# EasyEDA Pro project ProProject_AT_START_F426 V1.0.epro, board AT-START-F426-V1.0
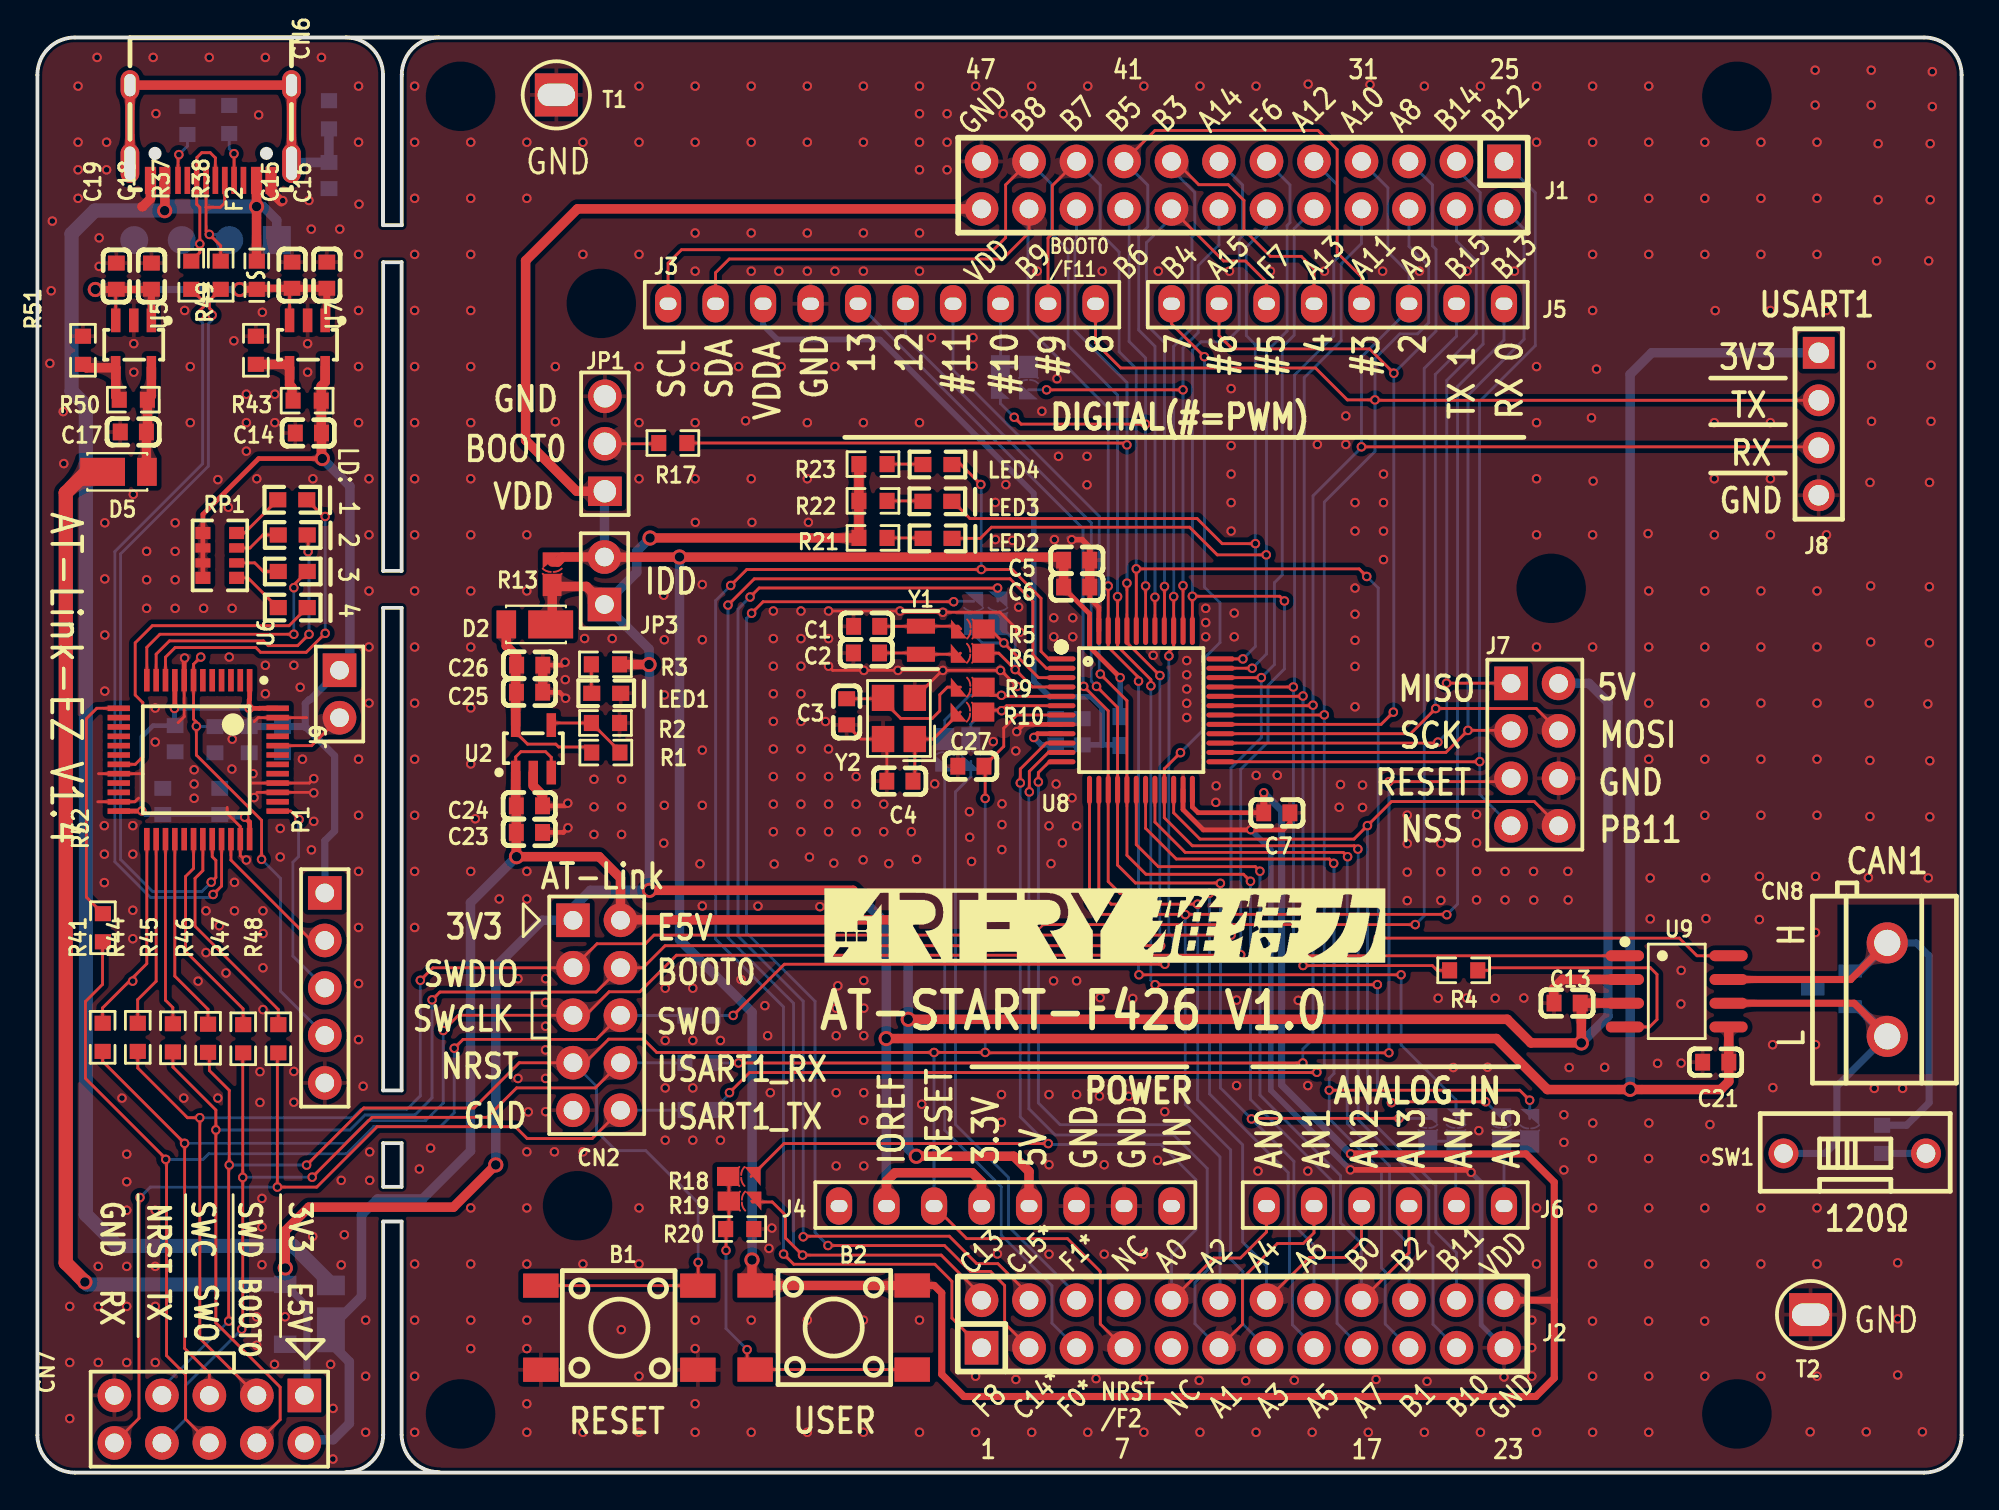
[diagram p4: board, top side]
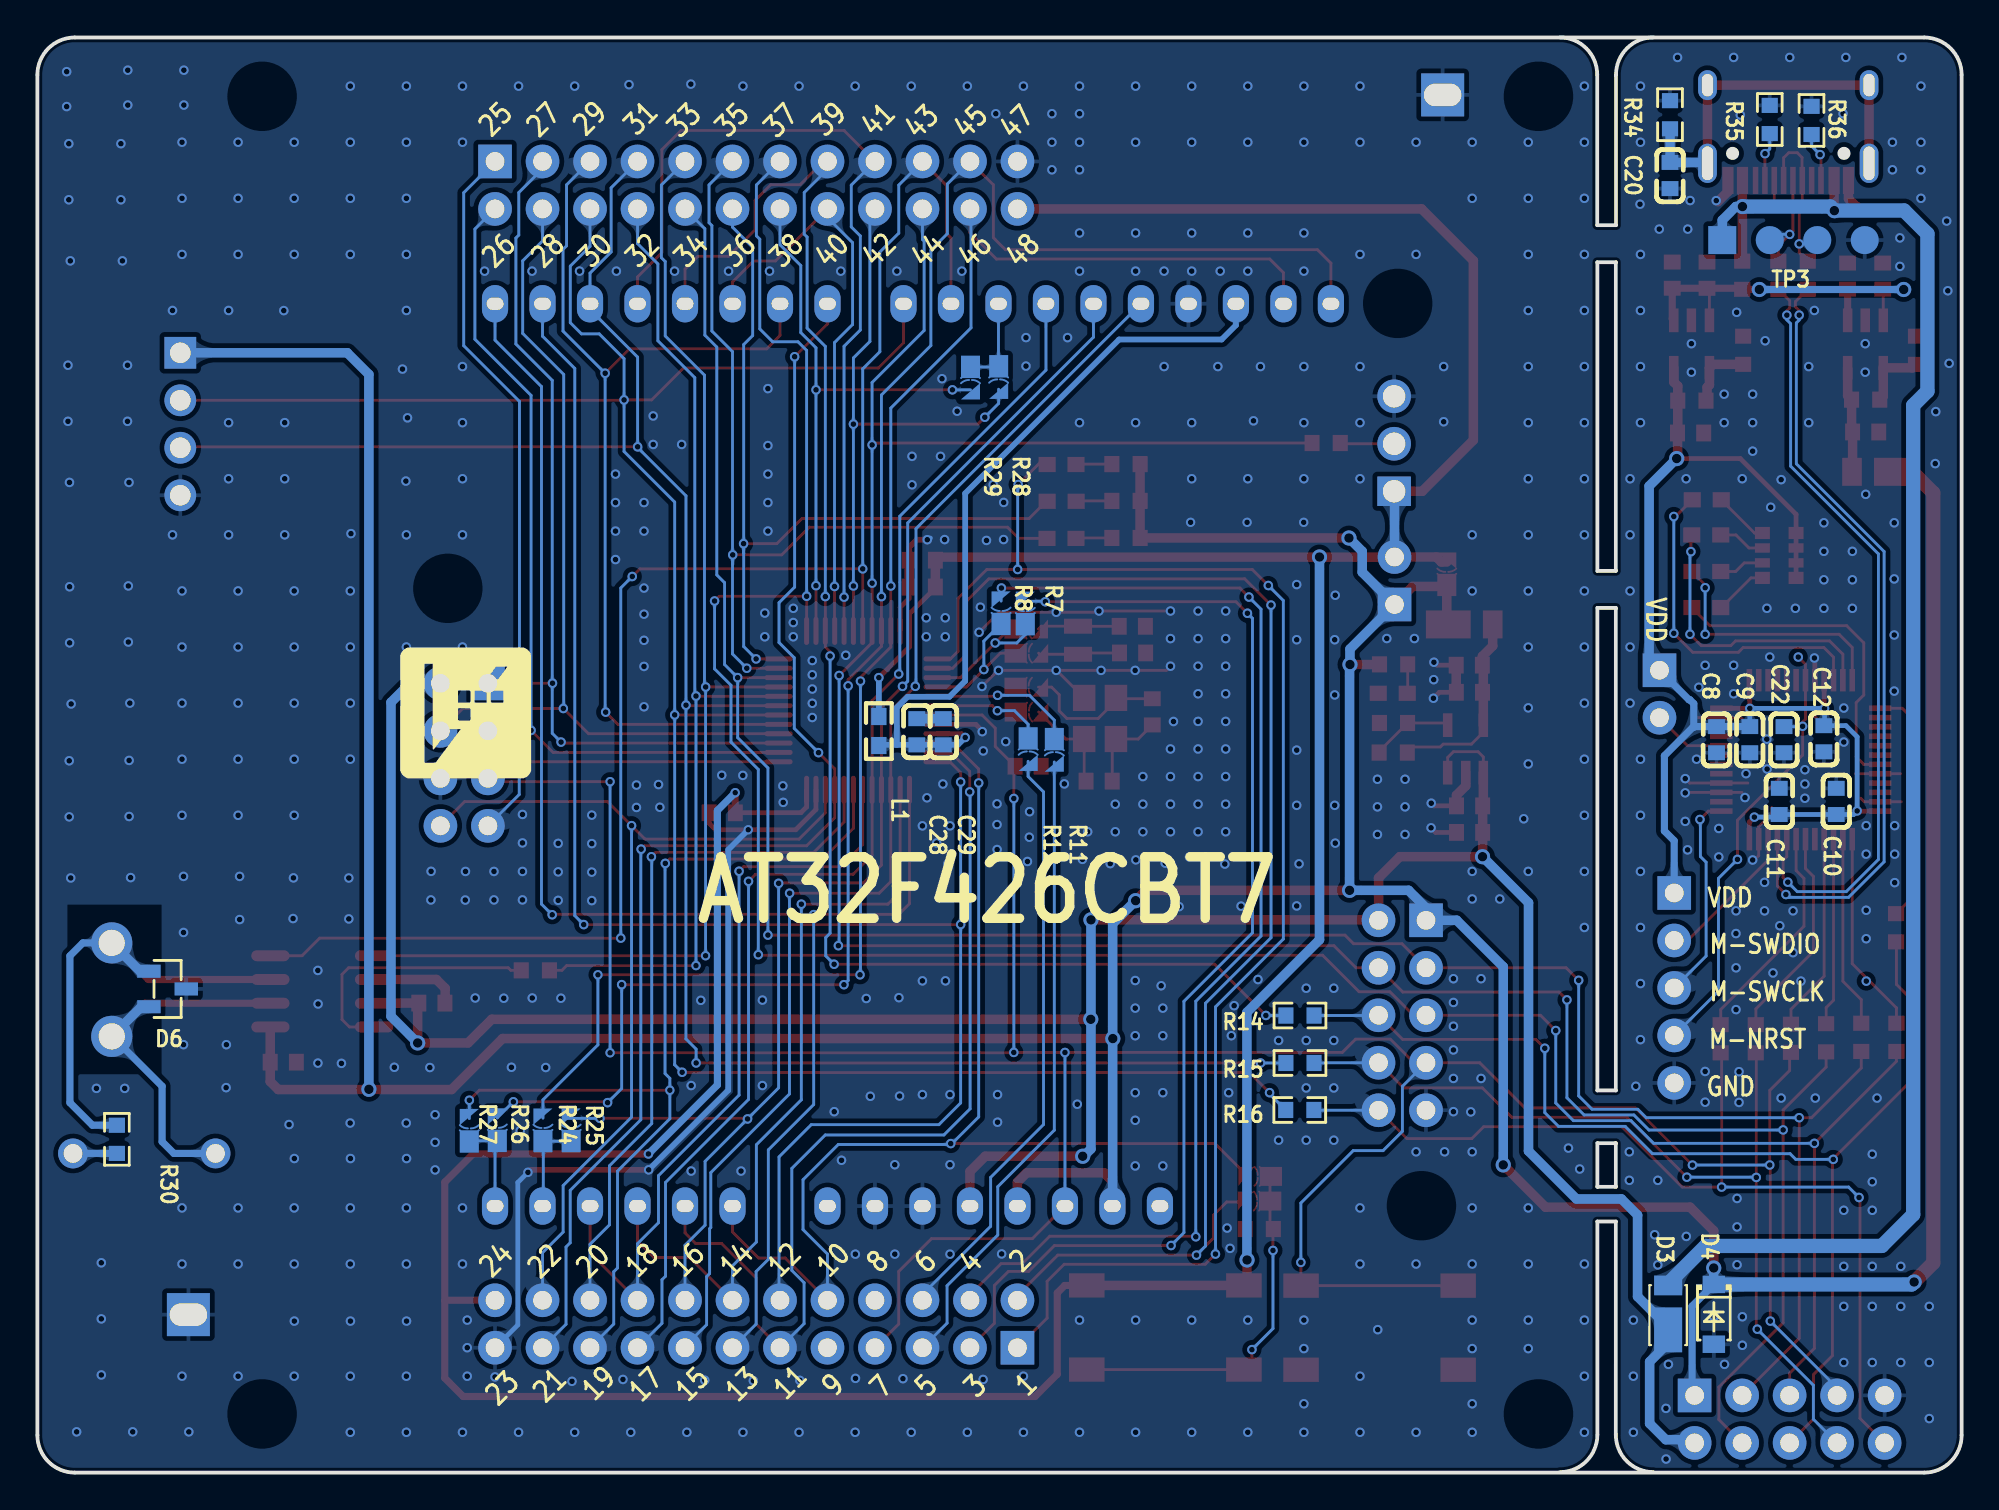
[diagram p5: board, bottom side, seen from below]

Outline 102.91 x 76.76 mm; copper layers: Top Layer, Bottom Layer. Coordinates in mm from the lower left corner of the outline.
Outline path: 16.48,76.76 arc(17.9,76.18) 18.48,74.76 18.48,66.72 19.49,66.72 19.49,74.76 arc(20.07,76.18) 21.49,76.76 ; 16.49,0.03 arc(17.91,0.61) 18.49,2.03 18.49,13.43 19.48,13.43 19.48,2.03 arc(20.07,0.61) 21.48,0.02 ; 0,74.76 0,2 arc(0.59,0.59) 2,0 100.91,0 arc(102.32,0.59) 102.91,2 102.91,74.76 arc(102.32,76.17) 100.91,76.76 2,76.76 arc(0.59,76.17) 0,74.76 ; 18.49,64.74 19.48,64.74 19.48,48.23 18.49,48.23 18.49,64.74 ; 18.49,46.25 19.48,46.25 19.48,20.44 18.49,20.44 18.49,46.25 ; 18.49,17.62 19.48,17.62 19.48,15.29 18.49,15.29 18.49,17.62
Stack: Top Layer 0.0356mm / Dielectric1 0.32mm FR-4 er 4.8 / Bottom Layer 0.0356mm

## Design rules (mm)
template: 自定义配置
spacing copperThickness1oz (default): track to track 0.152, other pairs 0.152 to 0.3
track width copperThickness1oz (default): min 0.127, default 0.152, max 2.54
differential pair differentialPair (default): width min 0.127, default 0.254, max 2.54; gap min 0.152, default 0.152
via viaSize (default): diameter min 0.5, default 0.5, max 1.001; hole min 0.3, default 0.3, max 0.701

## Placement (name value [footprint] x y rotation side)
B1  TS-1002S-05026C  [KEY-SMD_4P-L6.0-W6.0-P4.50-LS9.0]  31.12 7.75 0 top
B2  TSA063G60-250  [KEY-SMD_4P-L6.1-W6.1-P4.50-LS9.0]  42.59 7.76 180 top
C1  18pF  [C0603]  44.35 45.26 0 top
C2  18pF  [C0603]  44.34 43.84 0 top
C3  15pF  [C0603]  43.28 40.69 90 top
C4  15pF  [C0603]  46.13 36.98 0 top
C5  4.7uF  [C0603]  55.58 48.8 180 top
C6  100nF  [C0603]  55.59 47.37 180 top
C7  100nF  [C0603]  66.28 35.29 180 top
C8  4.7uF  [C0603]  13.11 39.2 90 bottom
C9  100nF  [C0603]  11.33 39.2 90 bottom
C10  100nF  [C0603]  6.7 35.9 270 bottom
C11  100nF  [C0603]  9.75 35.9 270 bottom
C12  100nF  [C0603]  7.37 39.25 90 bottom
C13  100nF  [C0603]  81.81 25.11 0 top
C14  10uF  [C0603]  14.49 55.6 0 top
C15  10uF  [C0603]  13.62 64.04 270 top
C16  100nF  [C0603]  15.48 64.05 270 top
C17  10uF  [C0603]  5.13 55.66 0 top
C18  10uF  [C0603]  6.1 63.99 270 top
C19  100nF  [C0603]  4.22 63.99 270 top
C20  100nF  [C0603]  15.59 69.38 90 bottom
C21  100nF  [C0603]  89.76 21.95 0 top
C22  100nF  [C0603]  9.5 39.2 90 bottom
C23  10uF  [C0603]  26.31 34.24 0 top
C24  100nF  [C0603]  26.31 35.66 0 top
C25  10uF  [C0603]  26.32 41.74 0 top
C26  100nF  [C0603]  26.33 43.19 0 top
C27  100nF  [C0603]  49.92 37.78 0 top
C28  1uF  [C0603]  55.88 39.62 270 bottom
C29  100nF  [C0603]  54.46 39.62 270 bottom
CN2  CON10  [HDR2X5]  28.64 29.54 270 top
CN6  -  [USB-C-SMD_TYPEC-304-BCP16]  9.27 71.66 180 top
CN7  CON10  [HDR2X5]  14.28 4.13 180 top
CN8  KF301-5.0-2P  [CONN-TH_P5.00_KF301-5.0-2P]  98.93 25.83 90 top
D2  DFLS130L-7  [POWERDI-123_L2.8-W1.8-LS3.7-RD]  26.26 45.36 180 top
D3  DFLS130L-7  [POWERDI-123_L2.8-W1.8-LS3.7-RD]  15.7 8.82 90 bottom
D4  SMF3.3A  [SOD-123FL_L2.8-W1.8-LS3.8-RD]  13.25 8.47 270 bottom
D5  DFLS130L-7  [POWERDI-123_L2.8-W1.8-LS3.7-RD]  4.67 53.53 0 top
D6  PESD2CANFD24V-TR  [SOT-23-3_L2.9-W1.3-P1.90-LS2.4-BR]  95.94 25.87 0 bottom
F2  BSMD0603-050-6V  [F0603]  11.73 64.04 270 top
J1  Header 12X2  [HEAD2*12]  78.43 70.13 180 top
J2  Header 12X2  [HEAD2*12]  50.49 6.68 0 top
J3  CON10  [HDR1X10 - 2#]  56.59 62.52 180 top
J4  CON8  [HDR1X8 - 2#]  42.87 14.26 0 top
J5  CON8  [HDR1X8 - 2#]  78.43 62.52 180 top
J6  CON6  [HDR1X6 -2#]  65.73 14.26 0 top
J7  Header 4X2  [HDR2X4]  78.81 42.21 270 top
J8  PZ2.54-1*4-WZ  [HDR-TH_4P-P2.54-H-M-W7.7-P]  95.27 56.08 270 top
J9  1X2P_2.54M  [HDR1X2]  16.16 42.91 270 top
JP1  2.54-1*3P针  [HDR-TH_3P-P2.54-V-M-1]  30.35 55.03 90 top
JP3  1X2P_2.54M  [HDR1X2]  30.33 46.43 90 top
L1  BEAD  [r0603]  57.91 40.44 270 bottom
LD1  RED  [LED0603]  12.86 52.03 0 top
LD2  GREEN  [LED0603]  12.88 50.15 0 top
LD3  BLUE  [LED0603]  12.88 48.19 0 top
LD4  YELLOW  [LED0603]  12.88 46.26 0 top
LED1  RED  [LED0603]  29.65 41.68 0 top
LED2  RED  [LED0603]  47.37 49.96 0 top
LED3  YELLOW  [LED0603]  47.36 51.94 0 top
LED4  GREEN  [LED0603]  47.36 53.91 0 top
P1  Header 5  [HDR1X5]  15.37 31 270 top
R1  51kΩ  [R0603]  30.4 38.51 0 top
R2  15kΩ  [R0603]  30.38 40.09 0 top
R3  1kΩ  [R0603]  30.38 43.23 0 top
R4  330Ω  [R0603]  76.28 26.86 0 top
R5  0Ω  [SB-PAD_2]  50.02 45.12 0 top
R6  0Ω  [SB-PAD_2]  50.01 43.83 0 top
R7  NC  [SB-PAD_2]  50.07 45.96 270 bottom
R8  NC  [SB-PAD_2]  51.37 45.97 270 bottom
R9  0Ω  [SB-PAD_2]  50.01 42.01 0 top
R10  0Ω  [SB-PAD_2]  50 40.68 0 top
R11  NC  [SB-PAD_2]  48.52 38.65 90 bottom
R12  NC  [SB-PAD_2]  49.92 38.69 90 bottom
R13  0Ω  [SB-PAD_2]  27.53 48.06 270 top
R14  470Ω  [R0603]  35.39 24.45 180 bottom
R15  470Ω  [R0603]  35.39 21.91 180 bottom
R16  470Ω  [R0603]  35.4 19.4 180 bottom
R17  3.3kΩ  [R0603]  33.99 55.07 180 top
R18  0Ω  [SB-PAD_2]  37.52 15.84 180 top
R19  NC  [SB-PAD_2]  37.56 14.52 180 top
R20  100kΩ  [R0603]  37.56 13.03 0 top
R21  1kΩ  [R0603]  44.69 49.99 180 top
R22  1kΩ  [R0603]  44.69 51.97 180 top
R23  1kΩ  [R0603]  44.69 53.94 180 top
R24  NC  [SB-PAD_2]  75.87 18.31 270 bottom
R25  0Ω  [SB-PAD_2]  74.36 18.31 270 bottom
R26  NC  [SB-PAD_2]  78.31 18.32 270 bottom
R27  0Ω  [SB-PAD_2]  79.81 18.29 270 bottom
R28  NC  [SB-PAD_2]  51.5 58.59 90 bottom
R29  0Ω  [SB-PAD_2]  53.01 58.56 90 bottom
R30  120Ω  [R0603]  98.66 17.83 90 bottom
R34  1MΩ  [R0603]  15.59 72.63 90 bottom
R35  5.1kΩ  [R0603]  10.26 72.37 90 bottom
R36  5.1kΩ  [R0603]  8.03 72.32 90 bottom
R37  0Ω  [R0603]  8.23 64.04 270 top
R38  0Ω  [R0603]  9.8 64.04 270 top
R41  33Ω  [R0603]  3.49 23.28 270 top
R43  47kΩ  [R0603]  14.43 57.34 180 top
R44  33Ω  [R0603]  5.37 23.28 270 top
R45  33Ω  [R0603]  7.25 23.26 270 top
R46  33Ω  [R0603]  9.13 23.23 270 top
R47  33Ω  [R0603]  11.01 23.21 270 top
R48  33Ω  [R0603]  12.89 23.21 270 top
R49  15kΩ  [R0603]  11.68 60.03 90 top
R50  51kΩ  [R0603]  5.13 57.39 180 top
R51  15kΩ  [R0603]  2.44 60.03 90 top
R52  33Ω  [R0603]  3.5 29.14 270 top
RP1  1kΩ  [RES-ARRAY-SMD_0603-8P-L3.2-W1.6-BL]  9.75 49.06 270 top
SW1  DSWB01LHGET  [SW-TH_DSWB01LHGET]  97.19 17.07 90 top
T1  Test point  [TestPoint]  27.75 73.69 0 top
T2  Test point  [TestPoint]  94.83 8.45 0 top
TP3  1X4P_2.54F  [HDR1X4 - TOP]  12.8 65.92 0 bottom
U2  RT9080N-08GJ5  [SOT-23-5]  28.12 39.09 90 top
U5  RT9080N-08GJ5  [SOT-23-5]  3.56 59.98 270 top
U6  AT32F403ACCT7  [LQFP48 - 2]  11.35 42.38 270 top
U7  RT9080N-08GJ5  [SOT-23-5]  12.85 59.98 270 top
U8  -  [LQFP-48_L7.0-W7.0-P0.50-LS9.0-BL]  59.02 40.77 270 top
U9  MCP2562FD-E/SN  [SOIC-8_L4.9-W3.9-P1.27-LS6.0-BL]  87.67 25.74 270 top
Y1  32.768KHz  [XTAL_SOP - FC-12M]  47.25 45.27 270 top
Y2  8MHz  [CRYSTAL-SMD_4P-L3.2-W2.5-BL]  46.08 40.34 90 top

## Footprints (pads in the part's own frame, mm; a bottom-side part is the same pattern mirrored in y, then rotated)
C0603
  rect 0.8x0.9 smd: 1(-0.7,0) 2(0.7,0)
CONN-TH_P5.00_KF301-5.0-2P
  round 2.2 hole 1.4: 1(-2.5,0) 2(2.5,0)
CRYSTAL-SMD_4P-L3.2-W2.5-BL
  rect 1.4x1.2 smd: 1(-1.1,-0.85) 2(1.1,-0.85) 3(1.1,0.85) 4(-1.1,0.85)
F0603
  rect 0.806x0.864 smd: 1(-0.753,0) 2(0.753,0)
HDR1X2
  rect 1.8x1.8 hole 1: 1(0,0)
  round 1.8 hole 1: 2(2.54,0)
HDR1X4 - TOP
  rect 1.5x1.5 smd: 1(0,0)
  round 1.5 smd: 2(-2.54,0) 3(-5.08,0) 4(-7.62,0)
HDR1X5
  rect 1.8x1.8 hole 1: 1(0,0)
  round 1.8 hole 1: 2(2.54,0) 3(5.08,0) 4(7.62,0) 5(10.16,0)
HDR1X6 -2#
  oval 1.4x2 hole 0.9x0.65: 1(0,0) 2(2.54,0) 3(5.08,0) 4(7.62,0) 5(10.16,0) 6(12.7,0)
HDR1X8 - 2#
  oval 1.4x2 hole 0.9x0.65: 1(0,0) 2(2.54,0) 3(5.08,0) 4(7.62,0) 5(10.16,0) 6(12.7,0) 7(15.24,0) 8(17.78,0)
HDR1X10 - 2#
  oval 1.4x2 hole 0.9x0.65: 1(0,0) 2(2.54,0) 3(5.08,0) 4(7.62,0) 5(10.16,0) 6(12.7,0) 7(15.24,0) 8(17.78,0) 9(20.32,0) 10(22.86,0)
HDR2X4
  rect 1.8x1.8 hole 1: 1(0,0)
  round 1.8 hole 1: 2(0,2.54) 3(2.54,0) 4(2.54,2.54) 5(5.08,0) 6(5.08,2.54) 7(7.62,0) 8(7.62,2.54)
HDR2X5
  rect 1.8x1.8 hole 1: 1(0,0)
  round 1.8 hole 1: 2(0,2.54) 3(2.54,0) 4(2.54,2.54) 5(5.08,0) 6(5.08,2.54) 7(7.62,0) 8(7.62,2.54) 9(10.16,0) 10(10.16,2.54)
HDR-TH_3P-P2.54-V-M-1
  rect 1.575x1.8 hole 1.2: 1(-2.54,0)
  round 1.8 hole 1.2: 2(0,0) 3(2.54,0)
HDR-TH_4P-P2.54-H-M-W7.7-P
  rect 1.7x1.7 hole 1.1: 1(-3.81,0)
  round 1.7 hole 1.1: 2(-1.27,0) 3(1.27,0) 4(3.81,0)
HEAD2*12
  rect 1.8x1.8 hole 1: 1(0,0)
  round 1.8 hole 1: 2(0,2.54) 3(2.54,0) 4(2.54,2.54) 5(5.08,0) 6(5.08,2.54) 7(7.62,0) 8(7.62,2.54) 9(10.16,0) 10(10.16,2.54) 11(12.7,0) 12(12.7,2.54) 13(15.24,0) 14(15.24,2.54) 15(17.78,0) 16(17.78,2.54) 17(20.32,0) 18(20.32,2.54) 19(22.86,0) 20(22.86,2.54) 21(25.4,0) 22(25.4,2.54) 23(27.94,0) 24(27.94,2.54)
KEY-SMD_4P-L6.0-W6.0-P4.50-LS9.0
  rect 1.9x1.3 smd: 1(-4.2,2.25) 2(4.2,2.25) 3(-4.2,-2.25) 4(4.2,-2.25)
KEY-SMD_4P-L6.1-W6.1-P4.50-LS9.0
  rect 1.9x1.3 smd: 1(-4.2,2.25) 2(4.2,2.25) 3(-4.2,-2.25) 4(4.2,-2.25)
LED0603
  rect 0.914x0.813 smd: 1(-0.001,0.005) 2(1.548,0.005)
LQFP48 - 2
  rect 1.2x0.3 smd: 1(0,0) 2(0,-0.5) 3(0,-1) 4(0,-1.5) 5(0,-2) 6(0,-2.5) 7(0,-3) 8(0,-3.5) 9(0,-4) 10(0,-4.5) 11(0,-5) 12(0,-5.5) 25(8.5,-5.5) 26(8.5,-5) 27(8.5,-4.5) 28(8.5,-4) 29(8.5,-3.5) 30(8.5,-3) 31(8.5,-2.5) 32(8.5,-2) 33(8.5,-1.5) 34(8.5,-1) 35(8.5,-0.5) 36(8.5,0)
  rect 0.3x1.2 smd: 13(1.5,-7) 14(2,-7) 15(2.5,-7) 16(3,-7) 17(3.5,-7) 18(4,-7) 19(4.5,-7) 20(5,-7) 21(5.5,-7) 22(6,-7) 23(6.5,-7) 24(7,-7) 37(7,1.5) 38(6.5,1.5) 39(6,1.5) 40(5.5,1.5) 41(5,1.5) 42(4.5,1.5) 43(4,1.5) 44(3.5,1.5) 45(3,1.5) 46(2.5,1.5) 47(2,1.5) 48(1.5,1.5)
LQFP-48_L7.0-W7.0-P0.50-LS9.0-BL
  oval 0.27x1.501 smd: 1(-2.751,-4.25) 2(-2.251,-4.25) 3(-1.75,-4.25) 4(-1.25,-4.25) 5(-0.75,-4.25) 6(-0.249,-4.25) 7(0.249,-4.25) 8(0.75,-4.25) 9(1.25,-4.25) 10(1.75,-4.25) 11(2.251,-4.25) 12(2.751,-4.25) 25(2.751,4.25) 26(2.251,4.25) 27(1.75,4.25) 28(1.25,4.25) 29(0.75,4.25) 30(0.249,4.25) 31(-0.249,4.25) 32(-0.75,4.25) 33(-1.25,4.25) 34(-1.75,4.25) 35(-2.251,4.25) 36(-2.751,4.25)
  oval 1.501x0.27 smd: 13(4.25,-2.751) 14(4.25,-2.251) 15(4.25,-1.75) 16(4.25,-1.25) 17(4.25,-0.75) 18(4.25,-0.249) 19(4.25,0.249) 20(4.25,0.75) 21(4.25,1.25) 22(4.25,1.75) 23(4.25,2.251) 24(4.25,2.751) 37(-4.25,2.751) 38(-4.25,2.251) 39(-4.25,1.75) 40(-4.25,1.25) 41(-4.25,0.75) 42(-4.25,0.249) 43(-4.25,-0.249) 44(-4.25,-0.75) 45(-4.25,-1.25) 46(-4.25,-1.75) 47(-4.25,-2.251) 48(-4.25,-2.751)
POWERDI-123_L2.8-W1.8-LS3.7-RD
  rect 2.4x1.5 smd: 1(-1.188,0)
  rect 1.05x1.5 smd: 2(1.188,0)
R0603
  rect 0.806x0.864 smd: 1(-0.753,0) 2(0.753,0)
r0603
  rect 0.914x0.813 smd: 1(-0.001,0.005) 2(1.548,0.005)
RES-ARRAY-SMD_0603-8P-L3.2-W1.6-BL
  rect 0.65x0.8 smd: 1(-1.2,-0.9) 4(1.2,-0.9) 5(1.2,0.9) 8(-1.2,0.9)
  rect 0.5x0.8 smd: 2(-0.4,-0.9) 3(0.4,-0.9) 6(0.4,0.9) 7(-0.4,0.9)
SB-PAD_2
  custom 1.042x1.016 smd: 1(-0.64,-0.002)
  custom 1.194x1.016 smd: 2(0.579,-0.002)
SOD-123FL_L2.8-W1.8-LS3.8-RD
  rect 0.93x1.2 smd: 1(-1.6,0) 2(1.6,0)
SOIC-8_L4.9-W3.9-P1.27-LS6.0-BL
  oval 0.588x2.045 smd: 1(-1.905,-2.772) 2(-0.635,-2.772) 3(0.635,-2.772) 4(1.905,-2.772) 5(1.905,2.772) 6(0.635,2.772) 7(-0.635,2.772) 8(-1.905,2.772)
SOT-23-3_L2.9-W1.3-P1.90-LS2.4-BR
  rect 1.25x0.7 smd: 1(1,-0.95) 2(1,0.95) 3(-1,0)
SOT-23-5
  rect 1.27x0.508 smd: 1(-1.651,2.54) 2(-1.651,1.6) 3(-1.651,0.635) 4(0.889,0.635) 5(0.889,2.54)
SW-TH_DSWB01LHGET
  round 1.6 hole 1: 1(0,3.81) 2(0,-3.81)
TestPoint
  rect 2.3x2.3 hole 2x1.2: 1(0,0)
USB-C-SMD_TYPEC-304-BCP16
  oval 1.001x2.1 hole 0.6x1.801: 13(-4.321,1.633) 14(4.321,1.633)
  oval 1.001x1.6 hole 0.6x1.199: 15(-4.321,-2.547) 16(4.321,-2.547)
  rect 0.6x1.45 smd: A1B12(-3.226,2.547) A4B9(-2.451,2.547) B1A12(3.22,2.547) B4A9(2.451,2.547)
  rect 0.299x1.45 smd: A5(-1.25,2.547) A6(-0.249,2.547) A7(0.249,2.547) A8(1.25,2.547) B5(1.75,2.547) B6(0.75,2.547) B7(-0.75,2.547) B8(-1.75,2.547)
XTAL_SOP - FC-12M
  rect 0.8x1.5 smd: 1(0,0) 2(1.5,0)

## Nets
As in the schematic.

Pads without a net: CN6 A8 B8; J2 8 9; J4 1 8; U6 2 3 4 5 6 14 15 16 17 18 21 22 29 38 41 42 43 45 46

## Via types
v1: diameter 0.813, hole 0.508, Top Layer to Bottom Layer, 21 vias
v2: diameter 0.508, hole 0.305, Top Layer to Bottom Layer, 848 vias
v3: diameter 0.5, hole 0.3, Top Layer to Bottom Layer, 11 vias

## Routing (per net, layer and track width the routed paths; a pad name or vN(x,y) marks a point on that pad's centre or on a via; arc(x,y) is an arc through that point)
3V3: length 276.6
  Top Layer w0.508: v1(13.26,10.95) 13.26,12.94 14.52,14.2 22.25,14.2 v1(24.51,16.46) ; 45.4,23.22 78.03,23.22 80.76,20.49 90.03,20.49 90.46,20.92 C21.2 90.46,23.82 U9.5 ; 43.94,54.11 43.94,49.99 32.77,49.99 v1(32.77,49.99) ; JP3.1 29.36,47.4 27.62,47.4 27.53,47.49 27.53,45.45 D2.1 ; R3.2 31.14,43.22 v1(32.71,43.22) ; 45.41,14.26 45.41,15.59 45.86,16.04 50,16.04 50.49,15.54 J4.4 ; v1(44.17,30.59) 43.62,31.14 v1(32.73,31.14)
  Top Layer w0.762: D5.1 2.64,53.53 1.52,52.4 1.52,11.22 v1(2.54,10.19)
  Bottom Layer w0.381: D4.1 14.41,8.9 14.41,4.26 CN7.1
  Bottom Layer w0.508: v1(32.77,49.99) 32.06,49.28 32.06,48.16 JP3.1 32.71,44.05 v1(32.71,43.22) 32.73,43.2 v1(32.73,31.14) 29.57,31.14 28.64,30.21 CN2.1 27,29.54 24.51,27.05 v1(24.51,16.46) ; J8.1 86.34,59.89 85.18,58.74 v1(85.18,20.5) ; 45.41,14.26 45.4,14.27 45.4,29.36 v1(44.17,30.59) ; D4.1 13.26,10.07 v1(13.26,10.95)
  Bottom Layer w0.762: v1(2.54,10.19) 2.67,10.06 D4.1
  vias: v1(45.4,23.21)
GND: length 120.6
  Top Layer w0.152: C3.1 44.04,39.24 Y2.4 45.43,39.03 C4.1 ; 10.15,35.58 10.15,35.25 10.85,34.55 U6.35 10.85,33 11.18,32.67 ; U6.8 7.85,40.43 7.53,40.11 ; v2(42.31,46.08) v2(46.13,46.08) 46.2,46.02 v2(48.42,46.02) 51.48,46.02 v2(52.55,44.95) ; 48.4,42.91 v2(46.02,42.91) v2(44.2,42.91) 42.53,42.91 v2(42.31,43.13) ; 48.4,42.91 46.93,41.44 ; 48.4,42.91 51.54,42.91 51.73,42.72 51.73,42.71 v2(52.39,42.05) ; v2(14.78,37.12) 14.55,36.88 U6.40 11.43,36.88 ; 3.27,37.38 U6.20 5.68,37.38 ; 11.59,40.17 11.81,40.38 U6.47 14.4,40.38 ; 3.23,35.88 U6.23 5.21,35.88 5.41,36.08 ; v2(14.78,36.36) 14.76,36.38 U6.39 11.74,36.38
  Top Layer w0.254: C23.2 28.13,34.24 v2(28.37,34.49) ; 61.27,36.52 61.27,35.47 62.35,34.38 v3(64.89,34.38) 66.64,34.38 66.98,34.73 C7.1 ; C6.1 56.28,46.76 56.77,46.28 U8.47 ; v2(7.87,43.57) 7.85,43.55 U6.8 ; C25.2 27.93,41.74 v2(28.25,41.42) ; v2(28.37,35.8) 28.22,35.66 C24.2 ; v2(28.22,43.34) 28.06,43.19 C26.2 ; 54.77,40.02 52.72,40.02 52.38,39.68 v2(52.38,39.63)
  Top Layer w0.305: C5.1 56.28,49.49 55.88,49.9 v2(55.32,49.9) ; v2(70.22,16.19) 76.54,16.19 v2(76.67,16.06)
  Top Layer w0.508: C13.1 81.1,25.12 81.1,25.91 81.57,26.38 84.9,26.38 ; 13.04,67.98 12.5,68.52 CN6.A1B12 ; C24.2 27.01,36.23 26.52,36.73 U2.2 ; C25.2 27.03,41.75 C26.2 ; 5.59,67.71 5.63,67.71 6.05,68.13 CN6.B1A12 ; C5.1 56.28,47.37
  Bottom Layer w0.254: v2(55.32,49.9) 55.24,49.9 55.15,49.99 ; v2(76.67,16.06) 77.22,15.52 77.22,7.9 J2.23
  Bottom Layer w0.305: v2(70.22,16.19) 65.96,20.45 65.96,33.31 v3(64.89,34.38)
  Bottom Layer w0.508: C28.1 C29.1
  vias: v2(0.67,59.33) v2(0.8,66.94) v2(0.74,63.21) v2(1.38,56.75) v2(1.41,53.97) v2(1.73,8.89) v2(1.73,5.89) v2(1.73,2.89) v2(2.18,74.16) v2(2.18,71.16) v2(2.18,69.68) v2(2.18,68.16) v2(3.19,75.69) v2(3.25,11.03) v2(3.25,8.89) v2(3.25,5.89) v2(3.3,66.04) v2(3.3,64.52) v2(3.58,34.6) v2(3.58,33.08) v2(3.58,31.55) v2(3.7,71.16) v2(3.7,69.68) v2(3.6,50.8) v2(3.6,47.8) v2(3.6,44.8) v2(3.6,41.8) v2(4.52,20.03) v2(4.78,17.03) v2(4.78,15.56) v2(4.78,14.03) v2(4.78,11.03) v2(4.78,8.89) v2(4.78,5.89) v2(5.16,60.38) v2(5.16,58.86) v2(5.13,52.32) v2(5.1,34.6) v2(5.1,33.08) v2(5.1,30.08) v2(5.1,28.55) v2(5.84,49.28) v2(5.84,47.75) v2(5.84,46.23) v2(6.19,75.69) v2(6.3,40.89) v2(6.3,39.08) v2(6.34,72.69) v2(6.3,14.03) v2(6.3,11.03) v2(6.3,8.89) v2(6.3,5.89) v2(7.37,50.8) v2(7.37,49.28) v2(7.37,47.75) v2(7.37,46.23) v2(7.88,62.16) v2(7.83,20.03) v2(8.18,59.16) v2(8.18,56.16) v2(8.38,37.59) v2(8.38,36.83) v2(8.38,36.07) v2(8.59,26.29) v2(8.89,46.23) v2(9.02,30.05) v2(9.02,27.81) v2(9.19,75.69) v2(9.65,53.11) v2(9.65,20.03) v2(9.72,29.25) v2(10.09,26.72) v2(10.21,51.63) v2(10.26,43.62) v2(10.41,46.23) v2(10.42,39.23) v2(10.4,37.63) v2(10.51,60.54) v2(10.54,31.57) v2(10.54,30.05) v2(11.18,57.68) v2(11.18,56.16) v2(11.18,54.63) v2(11.18,32.77) v2(11.53,37.38) v2(11.59,36.1) v2(11.73,53.16) v2(11.73,8.33) v2(11.73,6.81) v2(11.84,72.62) v2(11.9,21.44) v2(11.9,19.8) v2(12.03,62.06) v2(12.06,30.05) v2(12.07,28.83) v2(12.06,27) v2(12.06,24.76) v2(12.01,14.66) v2(12.01,13.14) v2(12.01,11.12) v2(12.19,75.69) v2(12.19,43.18) v2(12.19,41.66) v2(12.7,57.68) v2(12.7,56.16) v2(12.68,5.79) v2(12.99,34.45) v2(12.99,32.93) v2(13.12,68.03) v2(13.25,8.33) v2(13.72,43.18) v2(13.72,21.46) v2(13.72,19.81) v2(14.05,42.01) v2(14.18,38.16) v2(14.45,60.38) v2(14.45,58.86) v2(14.52,68.04) v2(14.65,66.51) v2(14.66,33.31) v2(14.73,53.16) v2(14.78,34.83) v2(14.72,12.63) v2(15.19,75.69) v2(15.68,5.79) v2(15.81,3.44) v2(15.81,0.73) v2(16.17,66.51) v2(16.25,15.63) v2(16.25,11.11) v2(16.41,12.72) v2(17.18,74.16) v2(17.18,71.16) v2(17.2,67.84) v2(17.18,65.16) v2(17.18,62.16) v2(17.18,59.16) v2(17.18,56.16) v2(17.18,38.16) v2(17.18,35.16) v2(17.18,32.16) v2(17.18,29.16) v2(17.18,26.16) v2(17.18,23.16) v2(17.42,20.66) v2(17.56,8.16) v2(17.56,5.16) v2(17.56,2.16) v2(17.73,53.16) v2(17.73,50.16) v2(17.73,47.16) v2(17.73,44.16) v2(17.73,41.16) v2(17.77,17.16) v2(17.77,15.63) v2(20.18,74.16) v2(20.18,71.16) v2(20.18,68.16) v2(20.18,65.16) v2(20.18,62.16) v2(20.18,59.16) v2(20.18,56.16) v2(20.18,53.16) v2(20.18,50.16) v2(20.18,47.16) v2(20.18,44.16) v2(20.18,41.16) v2(20.18,38.16) v2(20.18,35.16) v2(20.18,32.16) v2(20.18,29.16) v2(20.18,11.16) v2(20.18,8.16) v2(20.18,5.16) v2(20.18,2.16) v2(20.43,16.24) v2(21.03,17.36) v2(23.18,71.16) v2(23.18,68.16) v2(23.18,65.16) v2(23.18,62.16) v2(23.18,59.16) v2(23.18,56.16) v2(23.18,53.16) v2(23.18,50.16) v2(23.18,47.16) v2(23.18,44.16) v2(23.18,40.9) v2(23.18,37.9) v2(23.18,32.16) v2(23.18,14.16) v2(23.18,11.16) v2(23.18,8.16) v2(23.18,6.63) v2(23.42,34.97) v2(24.7,30.68) v2(25.7,26.42) v2(25.7,21.08) v2(26.18,71.16) v2(26.18,68.16) v2(26.18,50.16) v2(26.18,47.16) v2(26.18,32.16) v2(26.18,30.68) v2(26.18,17.16) v2(26.18,14.16) v2(26.18,11.16) v2(26.18,8.16) v2(26.18,6.63) v2(26.18,3.68) v2(26.18,2.16) v2(26.25,19.29) v2(27.18,26.42) v2(27.18,25.15) v2(27.18,23.88) v2(27.18,22.61) v2(27.18,21.08) v2(27.18,19.3) v2(27.7,59.16) v2(27.7,56.21) v2(27.65,17.16) v2(28.23,42.41) v2(29.18,71.16) v2(29.18,65.16) v2(29.18,17.16) v2(29.18,11.16) v2(29.18,2.16) v2(29.27,44.61) v2(29.77,37.08) v2(29.77,35.61) v2(29.77,34.13) v2(30.74,44.61) v2(31.24,37.08) v2(31.24,35.61) v2(31.24,34.13) v2(31.23,7.65) v2(32.18,74.16) v2(32.18,71.16) v2(32.18,65.16) v2(32.18,59.16) v2(32.18,56.16) v2(32.18,53.16) v2(32.18,14.16) v2(32.18,11.16) v2(32.18,5.16) v2(32.18,2.16) v2(33.5,46.93) v2(33.5,33.67) v2(33.53,44.55) v2(33.53,41.59) v2(33.53,35.69) v2(33.58,25.91) v2(33.58,23.11) v2(33.58,20.57) v2(33.58,17.78) v2(35.05,25.91) v2(35.05,23.11) v2(35.05,20.57) v2(35.05,17.78) v2(35.18,74.16) v2(35.18,71.16) v2(35.18,66.3) v2(35.18,64.26) v2(35.18,59.16) v2(35.18,56.16) v2(35.18,53.16) v2(35.18,8.16) v2(35.18,6.63) v2(35.18,3.68) v2(35.18,2.16) v2(35.44,32.56) v2(35.56,47.5) v2(35.56,44.55) v2(35.56,38.64) v2(35.56,35.69) v2(35.56,30.31) v2(36.53,23.11) v2(36.53,17.78) v2(37.5,59.16) v2(37.63,26.37) v2(37.87,56.26) v2(38.18,74.16) v2(38.18,71.16) v2(38.18,66.3) v2(38.18,64.26) v2(38.18,53.16) v2(38.18,8.16) v2(38.18,2.16) v2(38.54,30.3) v2(38.91,24.97) v2(39.06,23.37) v2(39.2,20.32) v2(39.12,11.99) v2(39.28,13.08) v2(39.36,46.08) v2(39.36,44.61) v2(39.36,43.13) v2(39.36,41.66) v2(39.36,40.18) v2(39.36,38.7) v2(39.36,37.23) v2(39.36,35.75) v2(39.36,34.28) v2(39.4,32.55) v2(39.65,64.26) v2(39.78,59.16) v2(40.84,46.08) v2(40.84,44.61) v2(40.84,43.13) v2(40.84,41.66) v2(40.84,40.18) v2(40.84,38.7) v2(40.84,37.23) v2(40.84,35.75) v2(40.84,34.28) v2(41.18,74.16) v2(41.18,71.16) v2(41.18,66.3) v2(41.18,64.26) v2(41.18,56.16) v2(41.18,53.16) v2(41.18,8.16) v2(41.18,2.16) v2(41.29,32.92) v2(41.85,30.27) v2(42.15,40.17) v2(42.31,44.61) v2(42.31,38.7) v2(42.31,37.23) v2(42.31,35.75) v2(42.31,34.28) v2(42.59,32.6) v2(42.65,64.26) v2(42.65,59.16) v2(42.72,24.84) v2(42.72,23.37) v2(42.72,20.32) v2(42.72,16.4) v2(42.81,26.04) v2(43.79,37.23) v2(43.79,35.75) v2(43.79,34.28) v2(44.18,74.16) v2(44.18,71.16) v2(44.18,66.3) v2(44.18,64.26) v2(44.18,56.16) v2(44.16,32.77) v2(44.2,26.32) v2(44.2,24.84) v2(44.2,23.37) v2(44.2,20.32) v2(44.2,18.84) v2(44.2,16.4) v2(44.18,8.16) v2(44.18,2.16) v2(45.26,35.75) v2(45.26,34.28) v2(45.53,32.57) v2(46.74,34.28) v2(47.02,32.8) v2(47.18,74.16) v2(47.18,72.68) v2(47.18,71.16) v2(47.18,69.68) v2(47.18,66.3) v2(47.18,64.26) v2(47.18,56.16) v2(47.18,8.16) v2(47.18,2.16) v2(47.3,19.7) v2(47.82,60.71) v2(47.99,36.84) v2(48.42,42.91) v2(48.65,72.68) v2(48.65,71.16) v2(48.65,69.68) v2(49.85,35.35) v2(49.86,33.98) v2(49.96,32.69) v2(50.04,60.71) v2(50.04,59.18) v2(50.18,74.16) v2(50.18,5.16) v2(50.18,2.16) v2(51.12,39.1) v2(51.23,51.89) v2(51.24,49.91) v2(51.34,11.7) v2(51.51,42.91) v2(51.59,35.77) v2(51.59,34.66) v2(51.58,33.32) v2(51.56,20.22) v2(51.56,18.74) v2(51.65,72.68) v2(51.79,52.84) v2(52.15,49.86) v2(52.32,38.6) v2(52.33,4.98) v2(52.48,46.29) v2(53.18,74.16) v2(53.18,2.16) v2(53.47,64.26) v2(53.72,56.77) v2(54.1,34.59) v2(54.1,20.22) v2(54.1,16.47) v2(54.1,11.68) v2(54.21,32.57) v2(54.39,49.9) v2(54.36,45.72) v2(54.36,44.7) v2(54.35,26.3) v2(54.48,36.83) v2(54.53,58.51) v2(54.61,54.36) v2(54.81,33.68) v2(55.37,45.72) v2(55.37,44.7) v2(55.33,36.09) v2(55.58,34.59) v2(55.58,26.3) v2(55.58,20.22) v2(56.18,74.16) v2(56.13,54.36) v2(56.13,52.83) v2(56.18,2.16) v2(56.62,5.02) v2(56.8,20.14) v2(56.83,25.4) v2(56.94,64.26) v2(57.05,16.47) v2(57.05,11.68) v2(58.36,20.13) v2(58.58,25.36) v2(59.18,74.16) v2(59.16,11.68) v2(59.16,5.04) v2(59.18,2.16) v2(59.68,43.72) v2(59.94,64.26) v2(59.91,16.71) v2(60.29,19.3) v2(61.47,43.43) v2(61.47,42.67) v2(61.47,41.91) v2(61.47,41.15) v2(61.47,40.39) v2(62.18,74.16) v2(62.13,4.93) v2(62.18,2.16) v2(62.48,46.23) v2(62.48,45.47) v2(62.48,44.7) v2(63.04,36.73) v2(63.02,35.85) v2(63.75,64.26) v2(63.84,57.98) v2(63.84,54.93) v2(63.84,53.41) v2(63.84,51.88) v2(63.84,50.36) v2(64.01,45.97) v2(64.01,44.7) v2(64.13,25.27) v2(64.13,20.7) v2(64.62,4.92) v2(65.18,74.16) v2(65.18,37.29) v2(65.18,2.16) v2(65.28,16.13) v2(65.94,64.26) v2(66.31,37.3) v2(67.22,4.94) v2(67.43,25.26) v2(67.96,74.26) v2(67.94,20.7) v2(67.94,16.13) v2(68.18,2.16) v2(68.45,54.99) v2(68.83,64.26) v2(69.69,36.8) v2(69.62,35.59) v2(69.98,56.52) v2(69.98,54.99) v2(70.47,51.88) v2(70.47,50.36) v2(70.47,47.31) v2(70.47,45.91) v2(70.47,44.52) v2(70.47,43.12) v2(70.47,40.96) v2(70.87,36.77) v2(70.87,35.58) v2(71.18,2.16) v2(71.27,74.24) v2(71.59,4.98) v2(71.94,64.26) v2(71.99,53.41) v2(71.99,51.88) v2(71.99,50.36) v2(71.99,48.83) v2(73.26,35.17) v2(73.26,33.64) v2(73.26,32.12) v2(73.26,30.59) v2(73.91,64.26) v2(74.18,74.16) v2(74.18,2.16) v2(74.32,4.88) v2(74.91,25.37) v2(75.06,33.66) v2(75.06,32.13) v2(75.06,30.61) v2(75.72,21.67) v2(76.45,64.26) v2(76.44,25.38) v2(76.97,35.2) v2(76.97,33.68) v2(76.97,32.15) v2(76.97,30.63) v2(77.09,18.29) v2(77.18,74.16) v2(77.18,2.16) v2(77.56,21.68) v2(77.97,25.37) v2(78.49,32.15) v2(78.49,30.63) v2(78.44,5.12) v2(78.99,64.26) v2(79.5,25.38) v2(79.92,8.16) v2(79.92,6.68) v2(79.92,5.16) v2(80.02,32.15) v2(80.03,30.62) v2(80.18,74.16) v2(80.18,71.16) v2(80.18,59.16) v2(80.18,56.16) v2(80.18,53.16) v2(80.18,50.16) v2(80.18,44.16) v2(80.18,14.16) v2(80.18,11.16) v2(80.18,2.16) v2(81.64,19.14) v2(81.64,17.67) v2(81.64,16.19) v2(81.85,32.16) v2(81.87,30.63) v2(81.92,21.67) v2(83.18,74.16) v2(83.18,71.16) v2(83.18,68.16) v2(83.18,65.16) v2(83.18,62.16) v2(83.11,56.42) v2(83.18,50.16) v2(83.18,44.16) v2(83.18,18.7) v2(83.17,16.8) v2(83.18,14.16) v2(83.18,11.16) v2(83.17,8.1) v2(83.18,5.16) v2(83.18,2.16) v2(83.2,53.03) v2(83.38,59.02) v2(83.82,21.68) v2(86.18,74.16) v2(86.18,71.16) v2(86.18,68.16) v2(86.18,65.16) v2(86.14,50.22) v2(86.18,47.16) v2(86.18,44.16) v2(86.18,41.16) v2(86.18,38.16) v2(86.18,18.7) v2(86.17,16.8) v2(86.18,14.16) v2(86.18,11.16) v2(86.17,8.1) v2(86.18,5.16) v2(86.18,2.16) v2(86.25,31.8) v2(86.25,29.62) v2(86.65,21.89) v2(87.9,25.07) v2(87.91,26.86) v2(87.91,21.9) v2(89.18,71.16) v2(89.18,68.16) v2(89.18,65.16) v2(89.18,47.16) v2(89.18,44.16) v2(89.18,41.16) v2(89.18,38.16) v2(89.18,35.16) v2(89.17,16.8) v2(89.18,14.16) v2(89.18,11.16) v2(89.17,8.1) v2(89.18,5.16) v2(89.22,31.81) v2(89.24,29.63) v2(89.45,18.62) v2(89.68,56.16) v2(89.68,53.16) v2(89.68,50.16) v2(89.73,62.15) v2(92.09,31.89) v2(92.09,29.58) v2(92.18,71.16) v2(92.18,68.16) v2(92.18,65.16) v2(92.18,47.16) v2(92.18,44.16) v2(92.18,41.16) v2(92.18,38.16) v2(92.18,35.16) v2(92.18,14.16) v2(92.18,11.16) v2(92.18,5.16) v2(92.68,62.16) v2(92.68,56.16) v2(92.68,53.16) v2(92.68,50.16) v2(92.8,22.89) v2(92.82,20.59) v2(94.81,2.18) v2(95.08,75.01) v2(95.08,73.14) v2(95.09,31.89) v2(95.09,28.89) v2(95.09,22.89) v2(95.18,71.16) v2(95.18,68.16) v2(95.18,65.16) v2(95.18,47.16) v2(95.18,44.16) v2(95.18,41.16) v2(95.18,38.16) v2(95.18,35.16) v2(95.18,14.16) v2(95.18,11.16) v2(95.18,5.16) v2(95.68,62.16) v2(95.68,50.16) v2(97.81,2.18) v2(97.97,41.16) v2(97.92,31.82) v2(98.08,75.01) v2(98.08,73.14) v2(98.09,59.23) v2(98.09,56.23) v2(98.01,52.96) v2(98.05,47.42) v2(98.05,44.42) v2(98,38.09) v2(98,35.09) v2(98.24,20.55) v2(98.36,64.81) v2(98.44,71.08) v2(98.44,68.08) v2(99.49,11.22) v2(99.49,8.22) v2(99.49,5.22) v2(99.75,20.55) v2(100.81,2.18) v2(101.15,64.81) v2(101.19,52.96) v2(101.19,47.38) v2(101.19,44.38) v2(101.11,41.11) v2(101.13,31.81) v2(101.23,71.08) v2(101.23,68.08) v2(101.27,59.23) v2(101.27,56.23) v2(101.21,38.07) v2(101.21,35.07) v2(101.34,74.93) v2(101.34,73.06) v3(35.19,50.83) v3(38.21,50.83) v3(41.23,50.83)
VCC: length 69.4
  Top Layer w0.254: RP1.4 RP1.3 RP1.2 RP1.1 8.85,51.26 11.84,54.24 v1(15.24,54.24) ; U6.48 11.86,40.88 11.86,40.88 v2(11.33,40.88) 11.33,41.34 11.35,41.36 U6.1 ; v2(11.08,35.06) 11.35,34.79 U6.36 ; v2(5.59,35.39) 5.58,35.38 U6.24 ; v2(7.33,40.87) 7.35,40.89 U6.9
  Top Layer w0.508: U7.5 15.39,58.33 15.18,58.12 R43.1 15.18,55.62 C14.2 15.19,54.28 v1(15.24,54.24)
  Bottom Layer w0.254: v2(11.08,35.06) 9.89,35.06 C11.2 C10.2 5.78,35.2 v2(5.59,35.39) 5.59,39.35 6.19,39.95 C12.2 7.33,39.99 v2(7.33,40.87) 7.34,40.88 v2(11.33,40.88) C9.2
  Bottom Layer w0.381: J9.1 14.58,41.33 14.53,41.33 14.32,41.13 14.32,39.87 ; 14.32,39.87 14.37,39.87 15.9,38.34 15.9,34.32 15.37,33.8 P1.1 ; 14.32,39.87 14.29,39.9 C8.2 C9.2
  Bottom Layer w0.508: J9.1 16.71,43.47 16.71,52.76 v1(15.24,54.24)
VCC3.5V: length 5.7
  Top Layer w0.508: U5.5 6.09,57.6 R50.1 5.88,55.71 C17.2 5.83,53.56 D5.2
VDD: length 221.8
  Top Layer w0.152: v1(34.34,48.97) 34.35,48.97
  Top Layer w0.254: 54.88,47.32 56.27,45.93 56.27,44.16 57.91,42.53 ; C7.2 65.58,35.3 62.08,35.3 61.77,35.6 61.77,36.52
  Top Layer w0.305: v2(57.91,42.52) 57.91,42.53
  Top Layer w0.381: v3(65.59,36.37) 65.59,35.29 C7.2 ; 81.12,9.19 81.12,15.53 79.61,17.04 v2(70.23,17.04) ; 81.12,9.19 81.12,5.06 80.14,4.07 49.55,4.07 48.37,5.26 48.37,9.61 47.97,10.01 B2.3 ; 81.12,9.19 81.09,9.22 J2.24
  Top Layer w0.508: 54.88,48.8 C6.2 ; JP1.1 28.84,52.49 26.11,55.22 26.11,64.82 28.88,67.59 J1.24 ; C5.2 54.72,48.96 34.35,48.97 30.33,48.97 JP3.2 28.09,48.97 27.83,48.7 27.53,48.7 ; v1(38.22,11.37) 38.22,10.18 B2.4 B2.3
  Bottom Layer w0.305: L1.1 v2(57.91,42.52)
  Bottom Layer w0.381: v3(65.59,36.37) 66.54,35.42 66.54,20.73 v2(70.23,17.04)
  Bottom Layer w0.508: JP3.2 30.33,52.47 JP1.1 ; v1(38.22,11.37) 38.22,11.38 38.22,24.62 34.34,28.5 v1(34.34,48.97)
VDDA: length 42
  Top Layer w0.254: 54.77,39.52 53.49,39.52 v2(53.29,39.32)
  Bottom Layer w0.305: 56.94,38.92 C28.2 C29.2 53.68,38.92 v2(53.29,39.32) ; 56.94,38.92 57.87,38.92 L1.2 ; 56.94,38.92 56.94,40.92 56.37,41.5 54.13,41.5 53.29,42.34 53.29,52.38 45.06,60.6 39.57,60.6 38.81,61.37 J3.8
ATLINK_5V: length 86.4
  Top Layer w0.508: F2.1 11.72,64.81 v1(11.72,67.72) CN6.A4B9 ; v1(6.81,67.5) 6.82,67.51 CN6.B4A9
  Bottom Layer w0.508: 6.8,67.51 6.8,67.5 v1(6.81,67.5) ; TP3.1 12.8,66.99 12.07,67.72 v1(11.72,67.72)
  Bottom Layer w0.762: v1(11.72,67.72) 7.01,67.72 6.8,67.51 3.08,67.51 1.83,66.26 1.83,57.84 2.59,57.08 2.59,13.8 4.27,12.12 13.68,12.12 15.7,10.11 D3.2
ATLK_BOOT0: length 10.1
  Top Layer w0.152: U6.27 6.85,25.26 7.24,24.87 7.24,23.99
ATLK_NRST: length 10.6
  Top Layer w0.152: 9.12,23.97 9.12,24.78 7.35,26.55 U6.28
ATLK_RX: length 52.5
  Top Layer w0.152: CN7.10 5.43,2.91 5.43,14.66 v2(5.49,14.72) ; CN2.10 29.67,17.87 26.19,17.87 25.56,18.5 18.17,18.5 14.94,15.27 v2(12.84,15.27) 12.83,22.4 R48.2
  Bottom Layer w0.152: R16.2 34.63,19.38 CN2.10 ; v2(5.49,14.72) 6.04,15.27 v2(12.84,15.27)
ATLK_SWCLK: length 10.8
  Top Layer w0.152: 3.48,24.02 3.48,24.85 5.85,27.22 U6.25
  vias: v2(5.1,26.29)
ATLK_SWDIO: length 10.3
  Top Layer w0.152: U6.26 6.35,26.28 5.36,25.29 5.36,24.02
ATLK_SWO: length 12.8
  Top Layer w0.152: R52.1 2.62,30.78 2.62,40.32 3.18,40.88 U6.13
ATLK_TX: length 48.9
  Top Layer w0.152: R47.2 10.98,22.43 v2(10.98,15.79) 10.98,7.73 v2(10.93,7.67) ; v2(14.69,15.8) 17.89,19 24.05,19 25.63,20.58 29.84,20.58 CN2.8
  Bottom Layer w0.152: CN7.8 7.93,2.86 7.93,4.67 v2(10.93,7.67) ; 34.63,21.91 34.01,21.91 34,21.92 CN2.8 ; v2(10.98,15.79) 11,15.8 v2(14.69,15.8)
CAN1_RX: length 54.1
  Top Layer w0.152: v2(67.69,41.54) 67.67,41.52 63.27,41.52 ; 75.53,26.86 74.86,26.86 74.6,27.12 v3(67.69,27.12)
  Bottom Layer w0.152: J1.8 70.81,65.74 69.72,64.65 69.72,60.54 67.75,58.56 67.75,41.6 v2(67.69,41.54) v3(67.69,27.12)
CAN1_STB: length 85.9
  Top Layer w0.152: v2(71.71,28.59) 87.81,28.59 88.75,27.65 U9.8 ; J3.2 54.05,66.04 54.28,66.27 54.28,68.84 55.57,70.13 ; v2(71.09,47.93) 70.69,48.34 v2(58.77,48.34) U8.43
  Bottom Layer w0.152: v2(58.77,48.34) 58.77,59.03 57.85,59.95 57.85,65.28 56.84,66.29 56.84,68.86 55.57,70.13 ; v2(71.09,47.93) 71.71,47.32 v2(71.71,28.59)
CAN1_TX: length 65.6
  Top Layer w0.152: 84.9,27.65 v3(67.17,27.65) ; 63.27,42.02 v2(67.17,42.02)
  Bottom Layer w0.152: J1.9 69.54,68.87 69.54,64.98 69.33,64.77 69.33,60.8 67.23,58.7 67.23,42.08 v2(67.17,42.02) 67.17,42.02 67.17,27.65
CAN_H: length 25.3
  Top Layer w0.381: CN8.2 96.98,26.38 U9.7
  Bottom Layer w0.381: CN8.2 100.48,28.33 101.17,27.64 101.17,19.79 99.96,18.58 R30.2
  Bottom Layer w0.508: CN8.2 97.42,26.82 D6.1
CAN_L: length 21.4
  Top Layer w0.381: CN8.1 97.16,25.11 U9.6
  Bottom Layer w0.381: 93.77,17.07 95.61,17.07 96.24,17.7 96.24,20.67 98.9,23.33 CN8.1
  Bottom Layer w0.508: CN8.1 97.35,24.92 D6.2
CC1: length 2.6
  Top Layer w0.152: CN6.A5 10.52,70.54 v2(10.51,70.54)
  Bottom Layer w0.152: v2(10.51,70.54) 10.26,70.8 R35.1
CC2: length 2.7
  Top Layer w0.152: v2(7.57,70.49) 7.52,70.45 CN6.B5
  Bottom Layer w0.152: R36.1 8.03,70.95 v2(7.57,70.49)
E5V: length 155.1
  Top Layer w0.152: U2.1 25.58,38.28 25.86,38.56 27.18,38.56 27.48,38.25 U2.3
  Top Layer w0.508: v1(46.56,29.56) 31.21,29.56 CN2.2 31.18,31.8 30.04,32.94 v1(25.62,32.94) 25.61,32.95 C23.1 C24.1 25.58,35.7 U2.1 ; v1(47.01,16.92) 52.22,16.92 53.03,16.1 J4.5 ; v1(46.57,24.25) 78.61,24.25 79.88,22.98 v1(82.57,22.98) 82.57,25.05 C13.2 84.9,25.11 84.9,25.11
  Bottom Layer w0.508: CN7.2 14.45,1.76 15.82,1.76 16.68,2.63 16.68,5.93 15.7,6.92 D3.1 15.7,7.78 17.33,9.42 17.33,13.77 18.19,14.64 20.6,14.64 23.16,17.2 23.16,30.48 v1(25.62,32.94) ; v1(46.56,29.56) 46.56,17.31 46.96,16.92 v1(47.01,16.92) ; J7.2 82.98,42.21 84,41.2 84,24.41 v1(82.57,22.98)
EGND: length 20.8
  Top Layer w0.508: CN6.13 CN6.15 CN6.16 CN6.14
  Bottom Layer w0.508: CN6.13 13.64,70.08 C20.2 R34.1
LD1: length 18.1
  Top Layer w0.152: v2(15.39,51.14) 15.3,51.14 14.41,52.03 ; U6.10 6.85,43.61 7.37,44.13 11.68,44.13 11.94,43.87 14.38,43.87 v2(15.39,44.89)
  Bottom Layer w0.152: v2(15.39,44.89) v2(15.39,51.14)
LD2: length 15.6
  Top Layer w0.152: v2(14.53,44.84) 13.92,44.23 12.34,44.23 12.09,44.48 7.06,44.48 6.35,43.77 U6.11 ; 14.43,50.15 14.48,50.1 v2(14.48,49.26)
  Bottom Layer w0.152: v2(14.48,49.26) 14.53,49.21 v2(14.53,44.84)
LD3: length 13.6
  Top Layer w0.152: v2(13.72,47.33) 13.72,47.48 LD3.2 ; U6.12 5.85,44.14 6.55,44.84 v2(13.72,44.84)
  Bottom Layer w0.152: v2(13.72,44.84) v2(13.72,47.33)
LD4: length 17.7
  Top Layer w0.152: 14.43,46.27 13.46,45.3 6.15,45.3 5.23,44.38 5.23,41.59 5.64,41.18 5.64,38.29 5.23,37.88 U6.19
M-ATLK_RX: length 12
  Top Layer w0.152: 12.88,23.94 12.88,24.77 8.43,29.22 8.43,31.79 8.85,32.2 U6.31
M-ATLK_TX: length 11.4
  Top Layer w0.152: 11,23.94 11,24.8 7.92,27.88 7.92,31.89 8.35,32.31 U6.30
M-BOOT0: length 3.9
  Top Layer w0.152: U6.44 14.66,38.88 J9.2
M-NRST: length 24.3
  Top Layer w0.152: v2(11.99,32.8) 11.99,34.89 8.5,38.38 8.5,40.15 8.35,40.3 U6.7 8.35,43.23 v2(8.74,43.62)
  Bottom Layer w0.152: v2(11.99,32.8) 13,31.78 13,25.75 P1.4 ; v2(8.5,39.92) 8.52,39.9 C22.2
M-SWCLK: length 11.2
  Top Layer w0.152: U6.37 13.55,35.38 v2(13.99,34.93)
  Bottom Layer w0.152: P1.3 13.66,27.63 13.66,32.65 13.97,32.95 13.97,34.91 v2(13.99,34.93)
M-SWDIO: length 7.9
  Top Layer w0.152: U6.34 10.35,32.76 14.65,28.46 P1.2
M-USB_DM: length 41.1
  Top Layer w0.152: v2(9.35,61.91) 9.35,62.14 9.19,62.29 9.19,62.68 R38.2 ; U6.32 9.35,32.94 9.55,32.75 9.55,31.83 v2(9.3,31.58)
  Bottom Layer w0.152: v2(9.3,31.58) 8.79,31.07 6.17,31.07 4.45,32.8 4.45,49.14 9.14,53.83 9.14,61.45 9.35,61.65 v2(9.35,61.91)
M-USB_DP: length 42.2
  Top Layer w0.152: v2(9.4,30.92) 9.85,31.37 U6.33 ; v2(8.69,61.91) 8.69,62.16 8.89,62.36 8.89,62.63 R37.2
  Bottom Layer w0.152: v2(9.4,30.92) 9.24,30.77 6.04,30.77 4.14,32.67 4.14,49.26 8.84,53.96 8.84,61.49 8.69,61.64 v2(8.69,61.91)
NRST/PF2: length 174.9
  Top Layer w0.152: v3(72.28,22.45) 50.71,22.45 v2(50.69,22.47) 47.96,22.47 ; 9.12,22.42 9.2,22.34 9.2,21.51 10.26,20.44 v2(10.26,16.45) 10.23,16.42 v2(10.23,8.1) ; 47.96,22.47 33.12,22.47 32.41,23.18 30.55,23.18 29.29,21.92 CN2.7 25.77,21.92 23.35,19.5 17.45,19.5 v2(14.4,16.45) ; 47.96,22.47 v2(47.95,22.47) ; J2.7 56.84,7.95 56.84,10.76 55.09,12.52 49.7,12.52 J4.3 ; J7.5 78.64,36.96 72.28,36.96 ; B1.1 B1.2 35.34,10.01 v2(35.34,11.24) ; U8.7 52.39,40.52 51.68,39.82 51.68,38.84 C27.2 50.69,37.72 v2(50.69,36.06)
  Bottom Layer w0.152: v3(72.28,22.45) v3(72.28,36.96) ; v2(35.34,11.24) 35.34,14.42 32.54,17.22 30.94,17.22 29.91,18.26 29.91,20.66 CN2.7 ; v2(10.26,16.45) 14.39,16.45 v2(14.4,16.45) ; CN7.7 6.66,4.53 v2(10.23,8.1) ; J4.3 v2(47.95,22.47) ; v2(50.69,36.06) 50.69,22.48
PA0: length 63.8
  Top Layer w0.152: 38.17,15.84 39.93,17.6 v2(54.06,17.6) ; U8.10 53.96,39.02 52.57,37.63 v2(52.57,36.89) ; J2.10 62.91,11.48 64.34,11.48 65.73,12.87 J6.1
  Bottom Layer w0.152: v2(52.57,36.89) 52.57,19.03 54.05,17.54 54.06,17.55 ; v2(54.06,17.6) 54.06,17.55 ; 54.06,17.55 60.08,17.55 61.96,15.66 61.96,13 60.65,11.69 J2.10
PA1: length 51.9
  Top Layer w0.152: J6.2 68.27,12.83 67.7,12.25 66.31,12.25 64.45,10.39 64.45,7.93 J2.11 ; U8.11 54.06,38.52 53.05,37.51 v2(53.05,36.41)
  Bottom Layer w0.152: v2(53.05,36.41) 53.03,36.38 53.03,19.46 54.43,18.06 60.77,18.06 62.56,16.27 62.56,10.82 61.91,10.16 61.91,7.97 J2.11
PA2: length 92
  Top Layer w0.152: 53.53,29.31 v2(73.69,29.31) ; v2(53.53,36.94) 53.53,37.44 54.11,38.02 U8.12
  Bottom Layer w0.152: v2(73.69,29.31) 74.17,29.79 74.17,59.06 75.89,60.78 J5.2 ; v2(53.53,36.94) v2(53.53,29.32) 53.53,19.77 54.69,18.61 61.52,18.61 63.25,16.89 63.25,9.27 J2.12
PA3: length 84.4
  Top Layer w0.152: U8.13 56.27,30.43 56.84,29.86 61.4,29.86 61.39,29.85 v2(61.39,29.85) 61.4,29.86 75.36,29.86 v2(75.38,29.84)
  Bottom Layer w0.152: v2(61.39,29.85) 61.39,19.69 63.82,17.26 63.82,11.41 64.47,10.76 64.47,7.94 J2.13 ; J5.1 78.43,60.57 75.95,58.09 75.95,30.41 v2(75.38,29.84)
PA4: length 42
  Top Layer w0.152: v2(62.05,30.4) 57.42,30.4 56.77,31.06 U8.14 ; J2.14 68.02,11.5 69.93,11.5 70.81,12.38 J6.3
  Bottom Layer w0.152: J2.14 65.73,11.06 64.46,12.33 64.46,17.53 62.05,19.94 v2(62.05,30.4)
PA5: length 68.7
  Top Layer w0.152: v2(55.96,42.06) 57.27,40.74 57.27,31.61 57.89,30.99 v2(62.68,30.99)
  Bottom Layer w0.152: J3.6 55.92,50.49 55.92,42.09 v2(55.96,42.06) ; v2(62.68,30.99) 62.69,30.98 62.69,20.25 66.89,16.04 66.89,13.11 66.96,13.05 66.96,10.64 67.12,10.48 67.12,7.91 68.27,6.75 J2.15
PA6: length 74.7
  Top Layer w0.152: v2(72.82,18.95) 64.96,18.95 v2(64.93,18.92) ; v2(63.27,31.52) 63.25,31.54 58.72,31.54 57.77,32.49 57.77,40.93 v2(56.64,42.05)
  Bottom Layer w0.152: J2.16 68.27,12.16 67.2,13.24 67.2,16.65 v2(64.93,18.92) 63.27,20.58 v2(63.27,31.52) ; v2(72.82,18.95) 74.64,18.95 74.64,18.94 ; J3.5 46.43,60.73 56.36,50.8 56.36,42.33 v2(56.64,42.05)
PA7: length 67.9
  Top Layer w0.152: v2(56.85,42.71) 58.27,41.29 58.27,33.02 59.29,32 64.5,32 v2(64.88,31.63)
  Bottom Layer w0.152: v2(56.85,42.71) 56.79,42.77 56.79,47.62 ; v2(64.88,31.63) 64.88,19.96 69.32,15.52 69.32,10.51 69.51,10.32 69.51,7.99 J2.17 ; 56.79,47.62 56.79,51.15 48.97,58.97 J3.4
PA8: length 52.4
  Top Layer w0.152: v2(72.52,40.67) 71.86,40.02 63.27,40.02 ; 63.19,62.52 63.19,60.81 63.91,60.1 71.24,60.1 v2(72.54,58.8)
  Bottom Layer w0.152: 73.35,70.13 74.61,68.87 74.61,65.61 74.8,65.43 74.8,61.05 v2(72.54,58.8) 72.54,40.7 v2(72.52,40.67)
PA9/USART1_TX: length 130.2
  Top Layer w0.152: v2(68.83,40.53) 68.82,40.52 63.27,40.52 ; J8.2 71.55,57.35 v2(71.53,57.37) 70.06,57.37 68.35,59.08 57.94,59.08 56.59,60.43 J3.1 ; v2(68.43,21.41) 68.41,21.4 38.09,21.4 v2(37.01,20.32)
  Bottom Layer w0.152: v2(68.43,21.41) 68.83,21.81 68.83,21.83 ; 36.91,20.16 36.15,19.4 ; 68.83,21.83 68.83,21.82 ; 68.83,21.83 v2(68.83,40.53) 68.83,51.91 71.53,54.62 v2(71.53,57.37) 71.53,59.58 72.86,60.91 73.81,60.91 74.41,61.51 74.41,64.53 73.35,65.58 73.35,67.59
PA10/USART1_RX: length 112.6
  Top Layer w0.152: v2(37.5,21.91) v2(67.68,21.91) ; 63.27,41.02 68.19,41.02 v2(68.22,41.05) ; J8.3 95.22,54.86 v2(70.81,54.86)
  Bottom Layer w0.152: v2(37.5,21.91) R15.1 ; J1.7 72.22,68.72 72.22,65.28 73.35,64.16 73.35,62.21 70.81,59.66 v2(70.81,54.86) 70.81,54.83 68.22,52.25 v2(68.22,41.05) 68.22,41.05 68.22,23.2 67.68,22.65 v2(67.68,21.91)
PA13/SWDIO: length 127.1
  Top Layer w0.152: v2(20.48,26.33) 21.15,27 CN2.3 29.93,28.29 32.52,28.29 32.98,28.75 v2(63.84,28.75) ; CN7.3 8.69,7.18 v2(8.69,18.98) 8.03,18.98 5.37,21.64 R44.2 ; 63.27,42.52 v2(65.46,42.52)
  Bottom Layer w0.152: v2(63.84,28.75) 63.84,37.69 65.46,39.31 v2(65.46,42.52) 66.16,43.22 66.16,47.6 66.57,48.01 66.57,60.2 67.21,60.84 67.21,66.53 J1.10 ; v2(20.48,26.33) 20.48,20.15 19.76,19.43 17.32,19.43 16.87,18.98 v2(8.69,18.98)
PA14/SWCLK: length 136.2
  Top Layer w0.152: R41.2 3.49,22 v2(7.87,17.61) 7.87,6.64 9.2,5.32 CN7.5 ; v2(66.69,46.62) 66.44,46.87 v2(61.77,46.87) 61.77,45.02 ; 64.35,27.7 64.33,27.67 34.18,27.67 32.22,25.72 30.58,25.72 29.32,24.46 CN2.5 22.52,24.46 v2(21.71,23.65)
  Bottom Layer w0.152: v2(7.87,17.61) 16.47,17.61 17.68,18.82 20.76,18.82 21.71,19.77 v2(21.71,23.65) ; v2(61.77,46.87) 61.77,60.02 62.23,60.48 63.59,60.48 64.27,61.17 64.27,65.97 64.46,66.15 64.46,68.87 63.19,70.13 ; v2(64.35,27.7) 64.35,37.61 65.81,39.07 65.81,42.11 66.69,42.99 v2(66.69,46.62)
PA15: length 31.6
  Top Layer w0.152: v2(53.97,57.91) v2(61.27,57.91) ; U8.38 v2(61.27,47.44)
  Bottom Layer w0.152: 53.01,57.91 v2(53.97,57.91) ; 63.19,67.59 63.19,65.67 62.08,64.56 62.08,60.98 61.27,60.16 v2(61.27,47.44)
PB0: length 41.4
  Top Layer w0.152: J6.4 73.35,11.76 J2.18 ; U8.18 58.77,33.59 59.95,32.41 65.14,32.41 v2(65.38,32.17)
  Bottom Layer w0.152: J2.18 70.81,12.24 69.69,13.37 69.69,15.88 65.38,20.19 v2(65.38,32.17)
PB1: length 52.6
  Top Layer w0.152: v3(69.09,20.45) 79.27,20.45 v2(79.81,19.92) ; v2(69.33,32.59) 69.1,32.82 60.91,32.82 59.27,34.46 U8.19
  Bottom Layer w0.152: 79.81,18.94 79.81,19.92 ; J2.19 72.09,7.95 72.09,10.74 71.88,10.95 71.88,16.13 69.09,18.93 v3(69.09,20.45) 69.09,21.09 69.34,21.35 69.34,32.57 v2(69.33,32.59)
PB2: length 37.9
  Top Layer w0.152: 59.77,36.52 59.77,34.79 61.39,33.17 69.84,33.17 v2(70.07,32.94)
  Bottom Layer w0.152: v2(70.07,32.94) 70.05,32.92 70.05,18.67 72.31,16.41 72.31,13.25 73.35,12.21 J2.20
PB3/SWO: length 82.4
  Top Layer w0.152: v2(37.21,24.45) 39.95,27.19 v2(60.3,27.19) ; v2(60.77,46.85) U8.39 60.77,44.16 60.52,43.9 v2(60.52,43.68) ; J1.15 60.87,70.13 62.12,68.88 63.69,68.88 64.53,68.04 64.53,66.47 65.94,65.05 67.59,65.05 68.27,64.37 J5.5
  Bottom Layer w0.152: v2(37.21,24.45) 37.2,24.45 R14.1 ; J1.15 60.65,69.71 61.9,68.47 61.9,66.24 61.75,66.09 61.75,61.21 60.77,60.24 v2(60.77,46.85) ; v2(60.3,27.19) 60.75,27.64 60.75,28.62 60.52,28.85 v2(60.52,43.68)
PB4: length 31.4
  Top Layer w0.152: U8.40 60.28,45.03 v2(60.28,47.4) ; J5.6 65.73,63.68 64.61,64.8 63.44,64.8 J1.16
  Bottom Layer w0.152: J1.16 60.65,67.13 59.31,65.78 59.31,61.41 60.28,60.44 v2(60.28,47.4)
PB5: length 47.5
  Top Layer w0.152: J1.17 59.77,71.79 68.49,71.79 69.51,70.76 69.51,65.25 70.81,63.95 J5.4 ; 59.77,45.02 59.77,46.82
  Bottom Layer w0.152: v2(59.77,46.83) 59.77,60.24 58.9,61.11 58.9,66.14 59.38,66.63 59.38,68.86 J1.17
PB6: length 32
  Top Layer w0.152: v2(59.27,56.08) 52.61,56.08 v2(52.24,56.45) ; U8.42 v2(59.27,47.42)
  Bottom Layer w0.152: v2(59.27,47.42) v2(59.27,56.08) 59.27,59.62 58.39,60.5 58.39,67.32 J1.18 ; 51.5,57.94 51.5,57.19 v2(52.24,56.45)
PB8: length 97
  Top Layer w0.152: v2(77.45,19.83) 72.46,19.83 v2(72.42,19.79) ; v2(59.78,26.1) 71.66,26.1 v2(71.66,26.1) ; J3.10 33.73,64.69 34.45,65.41 51.14,65.41 51.78,66.05 51.78,68.88 J1.21 ; v2(59.55,42.08) 59.55,42.41 57.77,44.19 U8.45 v2(57.77,46.85)
  Bottom Layer w0.152: v2(77.45,19.83) 78.31,18.98 78.31,18.97 ; J1.21 54.24,68.92 54.24,66.27 55.13,65.38 55.13,60.28 57.77,57.64 v2(57.77,46.85) ; v2(71.66,26.1) 71.66,20.54 v2(72.42,19.79) ; v2(59.78,26.1) 59.55,26.32 v2(59.55,42.08)
PB9: length 86.9
  Top Layer w0.152: v2(57.27,47.42) U8.46 57.27,44.15 58.89,42.53 v2(58.89,42.33) ; J1.22 53.03,66.32 51.62,64.91 37,64.91 36.27,64.18 J3.9 ; v3(72.93,26.63) v2(58.91,26.63)
  Bottom Layer w0.152: v2(58.89,42.33) 58.89,26.65 v2(58.91,26.63) ; 75.87,18.96 75.87,19.94 72.93,22.88 v3(72.93,26.63) ; J1.22 52.98,67.53 52.98,61.23 57.27,56.94 v2(57.27,47.42)
PB10: length 69.7
  Top Layer w0.152: J5.8 60.65,61.44 v2(62.41,59.68) ; v2(70.62,33.35) 70.44,33.53 61.77,33.53 60.27,35.03 60.27,37.64 v2(61.13,38.51)
  Bottom Layer w0.152: J2.21 74.64,7.94 74.64,12.07 74.41,12.29 74.41,15.1 70.64,18.87 70.64,33.33 v2(70.62,33.35) ; v2(61.13,38.51) 62.43,39.8 62.43,43.58 63.25,44.4 63.25,46.53 62.41,47.36 v2(62.41,59.68)
PB11: length 51.1
  Top Layer w0.152: J7.8 80.06,35.89 72.42,35.89 v2(71.13,34.6) 70.41,33.88 62.17,33.88 60.77,35.29 U8.22
  Bottom Layer w0.152: v2(71.13,34.6) 71.13,19.01 74.79,15.35 74.79,12.87 75.89,11.76 J2.22
PB12: length 52
  Top Layer w0.152: v2(77.14,38.03) 77.13,38.02 63.27,38.02
  Bottom Layer w0.152: J1.1 80.11,68.45 80.11,60.28 77.13,57.29 77.13,38.04 v2(77.14,38.03) 77.14,36.27 J7.7
PB13: length 45.6
  Top Layer w0.152: J7.3 78.79,39.7 v2(76.51,39.7) 75.33,38.52 63.27,38.52
  Bottom Layer w0.152: J1.2 79.51,66.51 79.51,60.62 76.51,57.62 v2(76.51,39.7)
PB14: length 47.8
  Top Layer w0.152: 63.27,39.02 74.85,39.02 v2(74.9,39.07) ; v2(75.36,42.22) 78.81,42.22 J7.1
  Bottom Layer w0.152: J1.3 75.89,69.73 77.16,68.46 77.16,66.19 77.32,66.03 77.32,60.36 75.37,58.42 75.37,39.54 v2(74.9,39.07)
PB15: length 47.2
  Top Layer w0.152: J7.4 80.16,40.87 v2(74.78,40.87) 73.43,39.52 63.27,39.52
  Bottom Layer w0.152: J1.4 75.89,65.87 76.95,64.81 76.95,60.93 74.76,58.74 74.76,40.89 v2(74.78,40.87)
PC13: length 73.8
  Top Layer w0.152: J2.2 50.49,9.48 48.34,11.63 v2(40.92,11.63) 40,12.55 40,13.77 39.3,14.48 38.25,14.48 38.21,14.52 ; U8.2 53.96,43.02 53.24,43.75 53.24,46.59 52.03,47.8 38.34,47.8 v2(36.93,46.4)
  Bottom Layer w0.152: v2(36.93,46.4) 36.93,28.61 40.44,25.1 40.44,12.12 v2(40.92,11.63)
PC14: length 62.1
  Top Layer w0.152: v2(49,46.58) 38.81,46.58 v2(38.2,45.96) ; 42.28,12.14 48.52,12.14 49.9,10.76 50.98,10.76 51.73,10.01 51.73,7.98 J2.3
  Bottom Layer w0.152: v2(49,46.58) 49.03,46.6 50.07,46.6 ; v2(38.2,45.96) 37.93,45.69 37.93,28.87 41.59,25.21 41.59,12.84 v2(42.28,12.15)
PC15: length 63.8
  Top Layer w0.152: v2(51.35,47.31) 38.6,47.31 v2(38.12,46.83) ; v2(40.96,12.61) 40.99,12.64 48.77,12.64 50.24,11.18 51.37,11.18 53.03,9.51 J2.4
  Bottom Layer w0.152: 51.37,46.62 51.37,47.3 v2(51.35,47.31) ; v2(38.12,46.83) 37.47,46.18 37.47,28.7 40.96,25.21 v2(40.96,12.61)
PF0: length 34.2
  Bottom Layer w0.152: J2.5 54.26,7.99 54.26,10 51.55,12.71 51.55,15.29 48.52,18.32 48.52,38.01
PF1: length 31.8
  Bottom Layer w0.152: 49.92,38.04 49.92,37.23 49.1,36.41 49.1,18.62 51.93,15.79 51.93,13.18 55.57,9.53 J2.6
PF6: length 48.3
  Top Layer w0.152: 63.27,43.02 63.27,43.02 v2(64.97,43.02) ; v2(65.72,49.09) 63.1,49.09 61.62,50.57 51.03,50.57 50.43,49.97 48.92,49.97
  Bottom Layer w0.152: v2(65.72,49.09) 65.72,48.59 65.73,48.58 ; J1.11 66.99,68.88 66.99,66.85 66.84,66.7 66.84,61.06 65.73,59.96 65.73,48.58 ; v2(64.97,43.02) 65.73,43.79 65.73,48.58
PF7: length 43.8
  Top Layer w0.152: 63.27,43.52 v2(64.47,43.52) ; v2(65.14,49.69) 63.36,49.69 62.02,51.03 49.87,51.03 48.95,51.95
  Bottom Layer w0.152: J1.12 65.73,66.61 64.66,65.54 64.66,60.81 65.14,60.33 65.14,49.18 ; v2(65.14,49.69) 65.14,49.18 65.14,49.18 ; 65.14,49.18 65.14,44.18 v2(64.47,43.52)
PF8: length 79.7
  Top Layer w0.152: 54.77,43.52 54.08,43.52 53.67,43.93 53.67,46.76 52.13,48.3 v2(50.48,48.3) 37.94,48.3 v2(37.08,47.45) ; 48.9,54.08 49.22,54.08 v2(50.46,52.85) ; J2.1 48.91,8.26 48.91,10.23 48,11.14 40.45,11.14 v2(39.91,11.69)
  Bottom Layer w0.152: v2(50.46,52.85) 50.48,52.82 v2(50.48,48.3) ; v2(39.91,11.69) 39.9,11.69 39.9,24.91 36.27,28.54 36.27,46.64 v2(37.08,47.45)
PF11/BOOT0: length 146.4
  Top Layer w0.152: v2(60.07,28.18) 33.57,28.18 32.39,27 CN2.4 29.89,25.7 21.53,25.7 v2(21.11,25.28) ; v2(58.27,54.97) 58.17,55.07 R17.1 ; v2(60.03,42.63) 60.03,42.63 58.27,44.39 U8.44 v2(58.27,47.57) ; CN7.4 12.98,2.83 12.98,4.57 9.55,8.01 v2(9.55,18.33) 9.55,19.39 7.25,21.69 R45.2
  Bottom Layer w0.152: v2(21.11,25.28) 21.11,20.05 20.19,19.13 17.53,19.13 16.72,18.32 9.55,18.32 v2(9.55,18.33) ; v2(60.07,28.18) 60.03,28.22 v2(60.03,42.63) ; v2(58.27,47.57) 58.27,58.3 55.49,61.09 55.49,65.87 55.57,65.95 55.57,67.59
SWO: length 62.9
  Top Layer w0.152: 6.88,16.78 2.57,21.08 2.57,25.2 3.48,26.11 3.48,28.37 R52.2 ; 6.88,16.78 6.91,16.75 6.91,6.26 7.93,5.24 7.93,2.86 CN7.6 ; 6.88,16.78 6.86,16.76 v2(6.86,16.75) ; CN2.6 29.89,23.17 22.76,23.17 v2(22.29,22.7)
  Bottom Layer w0.152: v2(6.86,16.75) 8.87,16.75 9.17,17.06 16.53,17.06 17.99,18.52 21.56,18.52 22.29,19.25 v2(22.29,22.7) ; CN2.6 31.2,24.45 R14.2
USBM: length 8.1
  Top Layer w0.152: 9.02,67.68 9.78,67.68 10.02,67.91 CN6.B7 ; 9.02,67.68 9.02,66.4 v2(9.19,66.23) 9.8,65.62 R38.1 ; 9.02,67.68 CN6.A7
  Bottom Layer w0.152: v2(9.19,66.23) 9.96,66.23 TP3.2
USBP: length 9.3
  Top Layer w0.152: R37.1 8.69,65.25 v2(8.69,65.72) 8.69,67.68 8.52,67.84 CN6.B6 8.53,69.13 8.53,70.34 8.79,70.6 9.24,70.6 9.52,70.32 CN6.A6
  Bottom Layer w0.152: TP3.3 7.92,65.72 v2(8.69,65.72)
$1N792: length 2.9
  Top Layer w0.152: RP1.8 11.08,50.26 12.86,52.03
$1N793: length 2.5
  Top Layer w0.152: 12.88,50.15 12.07,50.15 11.37,49.46 RP1.7
$1N794: length 2.4
  Top Layer w0.152: RP1.6 11.63,48.66 12.08,48.2 LD3.1
$1N795: length 2.9
  Top Layer w0.152: 12.88,46.27 12.85,46.27 11.26,47.86 RP1.5
$1N16959: length 22.3
  Top Layer w0.152: 4.21,63.28 4.19,63.26 U5.3 ; U7.3 13.49,63.21 C15.2
  Top Layer w0.381: 6.09,63.28 C18.2 ; 6.09,63.28 6.09,63.27 U5.1 ; 6.09,63.28 4.21,63.28 ; v1(3.1,63.28) 4.21,63.28 ; 4.21,63.28 C19.2 ; 15.48,63.34 C15.2 11.79,63.34 F2.2 10.83,63.29 v1(10.82,63.28) ; U7.1 15.48,61.72 C16.2
  Bottom Layer w0.381: v1(10.82,63.28) v1(3.1,63.28)
$1N17598: length 3.7
  Top Layer w0.508: R49.1 13.3,59.28 U7.4 13.49,58.17 13.61,58.05 13.61,57.4 R43.2
$1N17675: length 3.6
  Top Layer w0.508: R51.1 2.62,59.09 U5.4 4.19,57.57 R50.2
$2N438: length 4.4
  Top Layer w0.152: 49.36,43.83 49.31,43.77 Y1.2 47.18,43.84 C2.2
$2N5937: length 9
  Top Layer w0.152: 50.59,42.01 50.59,42 51.01,41.57 v2(51.56,41.57) 51.61,41.52 54.77,41.52
  Bottom Layer w0.152: 48.52,39.22 48.52,40.24 49.85,41.57 v2(51.56,41.57)
$2N5955: length 7.1
  Top Layer w0.152: 50.57,40.68 50.68,40.79 51.53,40.79 v2(51.57,40.75) 51.84,41.02 U8.6
  Bottom Layer w0.152: 49.92,39.26 49.92,40.03 50.65,40.75 v2(51.57,40.75)
$2N5975: length 4.4
  Top Layer w0.152: 49.38,45.12 49.23,45.27 Y1.1 47.25,45.26 C1.2
$2N6104: length 7.6
  Top Layer w0.152: 50.6,45.12 50.94,45.12 v2(51.69,44.38) 53.54,42.52 U8.3
  Bottom Layer w0.152: v2(51.69,44.38) 50.53,44.38 50.07,44.83 50.07,45.39
$2N6111: length 7.8
  Top Layer w0.152: U8.4 53.22,42.02 v2(52.29,42.95) 51.42,43.83 50.58,43.83
  Bottom Layer w0.152: v2(52.29,42.95) 52.29,44.47 51.37,45.4
$2N6210: length 7.8
  Top Layer w0.152: 43.28,41.39 45.18,41.39 Y2.3 45.23,41.29 46.18,40.34 47.85,40.34 48.26,40.74 48.26,41.61 48.67,42.01 49.37,42.01
$2N6248: length 5.3
  Top Layer w0.152: 49.35,40.68 47.91,39.24 46.93,39.24 46.93,37.08 C4.2
$2N7510: length 2.9
  Top Layer w0.152: R17.2 33.19,55.03 JP1.2
$3N526: length 1.6
  Top Layer w0.152: R3.1 29.62,41.7 LED1.1
$3N6624: length 10.5
  Top Layer w0.152: R1.1 29.35,38.81 27.88,38.81 27.73,38.96 26.21,38.96 25.58,39.6 U2.5
  Top Layer w0.508: U2.5 25.58,43.14 25.63,43.19 25.63,43.66 25.08,44.22 D2.2
$3N6989: length 1.9
  Top Layer w0.152: 47.37,49.97 47.35,49.99 R21.1
$3N7005: length 2
  Top Layer w0.152: 47.4,51.95 47.38,51.97 R22.1
$3N7010: length 1.9
  Top Layer w0.152: R23.1 47.33,53.94 47.35,53.92
$3N7265: length 4.4
  Top Layer w0.152: R1.2 31.15,38.57 R2.1 27.6,40.09 U2.4
$3N7356: length 19.5
  Top Layer w0.152: v2(37.96,6.58) 37.96,5.94 B2.2 B2.1 ; 36.95,15.84 36.99,15.8 36.99,13.21 R20.1 36.83,13.01 v2(36.83,11.88)
  Bottom Layer w0.152: v2(36.83,11.88) 36.83,7.7 v2(37.96,6.58)
$3N14088: length 14.1
  Top Layer w0.152: R4.2 77.59,26.86 77.73,27 86.26,27 86.62,26.65 86.62,24.23 86.22,23.84 84.9,23.84
$3N14090: length 2.7
  Bottom Layer w0.381: 101.39,17.07 101.38,17.07 98.66,17.07
$4N2984: length 5
  Bottom Layer w0.152: J6.5 75.85,14.3 75.85,17.72 ; 74.36,17.74 74.38,17.72 75.85,17.72 ; 75.85,17.72 75.87,17.74
$4N3391: length 5.1
  Bottom Layer w0.152: J6.6 78.43,17.63 78.31,17.75 79.78,17.75 79.81,17.72
$4N3469: length 4.9
  Bottom Layer w0.152: 53.01,59.13 51.71,59.13 51.51,59.34 ; 51.5,59.16 51.51,59.17 51.51,59.34 ; 51.51,59.34 J3.3
